# EAGLE schematic loa_v2 (EAGLE 5.12)

## Sheet 1 of 7
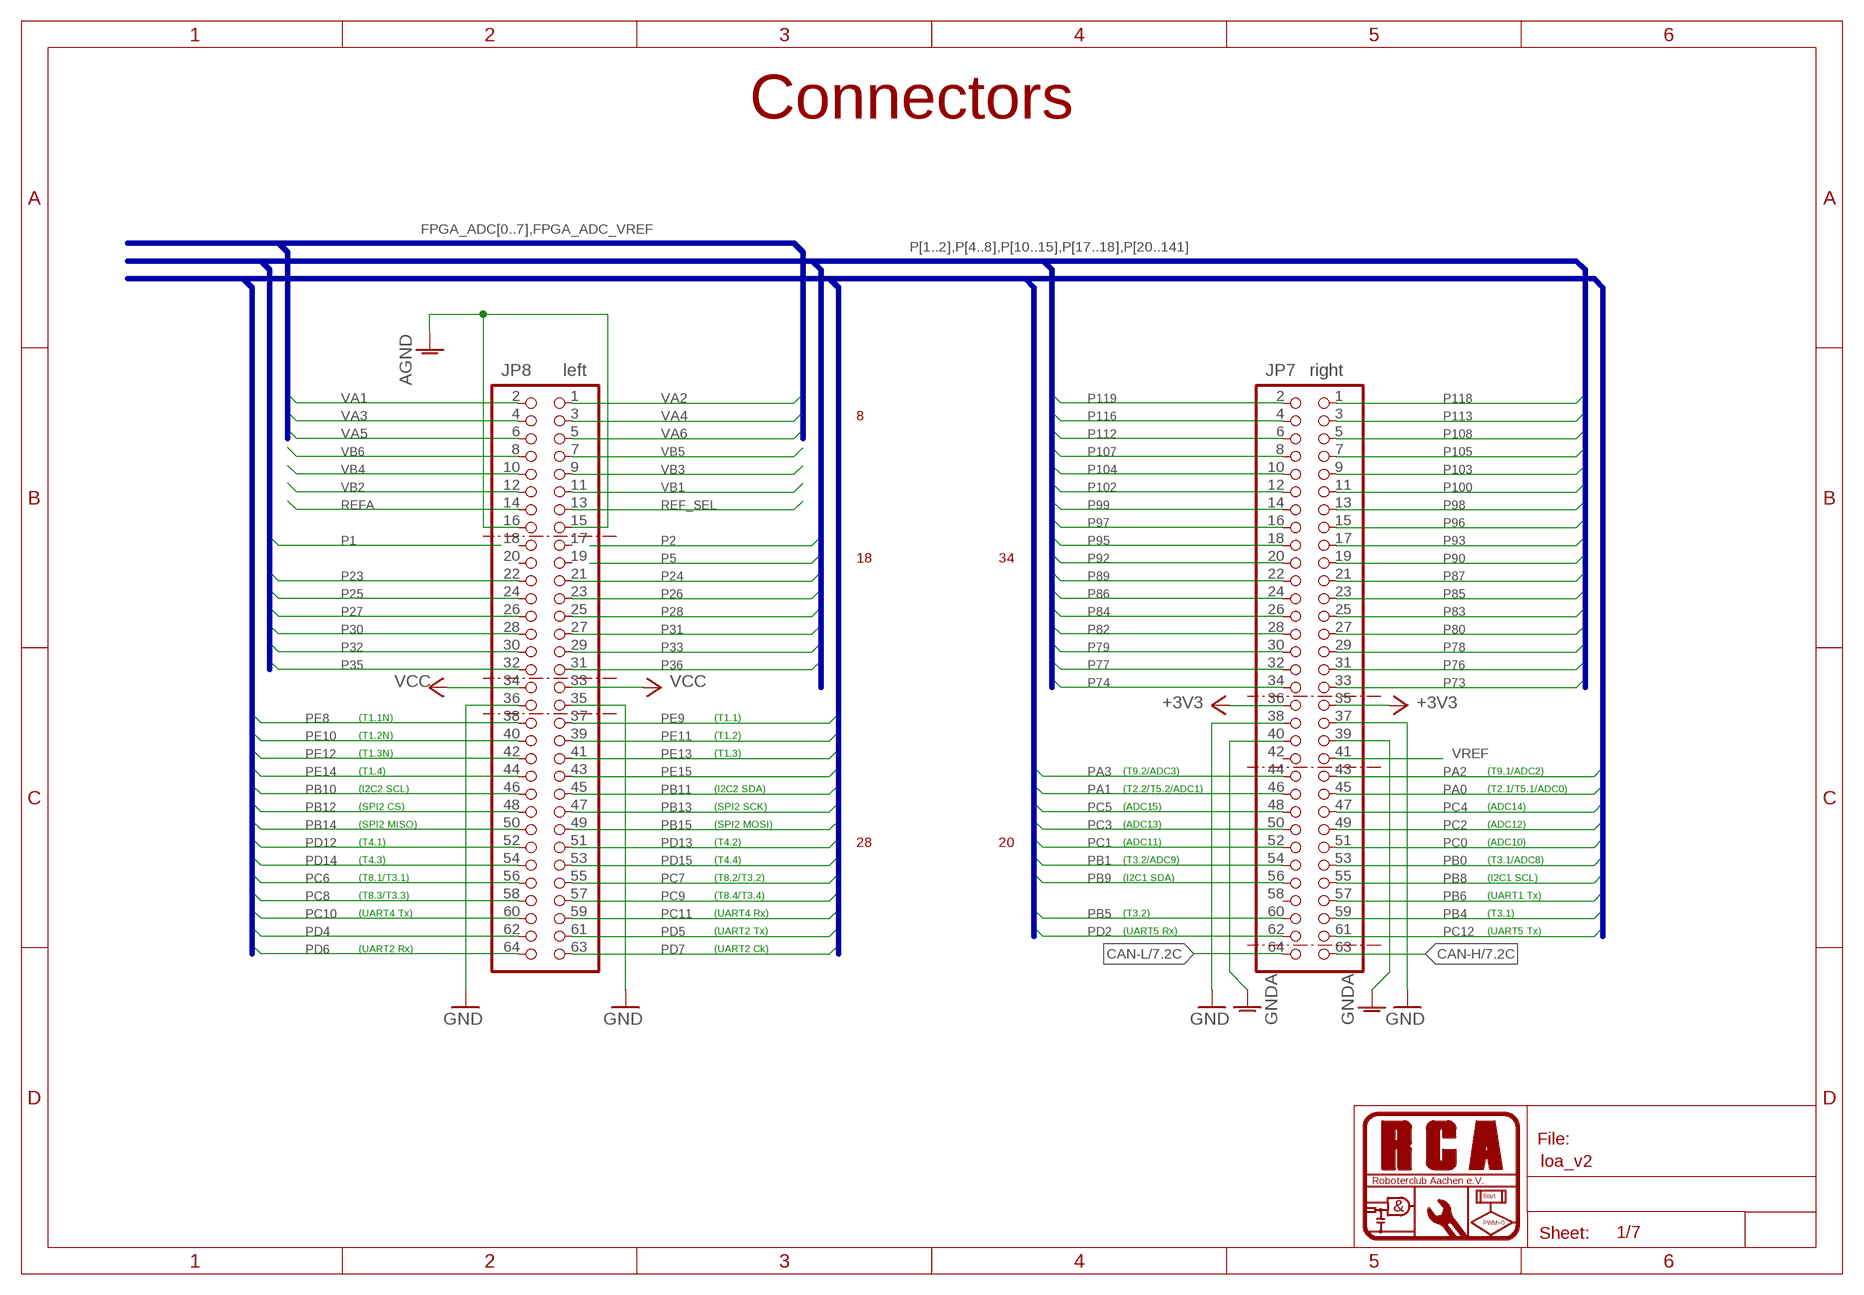
[diagram p0: schematic, sheet 1]

### Parts
JP7  right  PINHD-2X32_2.00-SMD  [2X32M_SMD]
JP8  left  PINHD-2X32_2.00-SMD  [2X32M_SMD]

### Nets
+3V3: JP7.35 JP7.36 ; also sheet 2,3,4,5,6,7
AGND: JP8.15 JP8.16 ; also sheet 3
CAN-H: JP7.63 ; also sheet 7
CAN-L: JP7.64 ; also sheet 7
GND: JP7.37 JP7.38 JP8.35 JP8.36 ; also sheet 2,3,4,5,6,7
GNDA: JP7.39 JP7.40 ; also sheet 6
P23: JP8.22 ; also sheet 2
P24: JP8.21 ; also sheet 2
P25: JP8.24 ; also sheet 2
P26: JP8.23 ; also sheet 2
P27: JP8.26 ; also sheet 2
P28: JP8.25 ; also sheet 2
P30: JP8.28 ; also sheet 2
P31: JP8.27 ; also sheet 2
P32: JP8.30 ; also sheet 2
P33: JP8.29 ; also sheet 2
P35: JP8.32 ; also sheet 2
P36: JP8.31 ; also sheet 2
P73: JP7.33 ; also sheet 2
P74: JP7.34 ; also sheet 2
P76: JP7.31 ; also sheet 2
P77: JP7.32 ; also sheet 2
P78: JP7.29 ; also sheet 2
P79: JP7.30 ; also sheet 2
P80: JP7.27 ; also sheet 2
P82: JP7.28 ; also sheet 2
P83: JP7.25 ; also sheet 2
P84: JP7.26 ; also sheet 2
P85: JP7.23 ; also sheet 2
P86: JP7.24 ; also sheet 2
P87: JP7.21 ; also sheet 2
P89: JP7.22 ; also sheet 2
P90: JP7.19 ; also sheet 2
P92: JP7.20 ; also sheet 2
P93: JP7.17 ; also sheet 2
P95: JP7.18 ; also sheet 2
P96: JP7.15 ; also sheet 2
P97: JP7.16 ; also sheet 2
P98: JP7.13 ; also sheet 2
P99: JP7.14 ; also sheet 2
P100: JP7.11 ; also sheet 2
P102: JP7.12 ; also sheet 2
P103: JP7.9 ; also sheet 2
P104: JP7.10 ; also sheet 2
P105: JP7.7 ; also sheet 2
P107: JP7.8 ; also sheet 2
P108: JP7.5 ; also sheet 2
P112: JP7.6 ; also sheet 2
P113: JP7.3 ; also sheet 2
P116: JP7.4 ; also sheet 2
P118: JP7.1 ; also sheet 2
P119: JP7.2 ; also sheet 2
PA0: JP7.45 ; also sheet 5
PA1: JP7.46 ; also sheet 5
PA2: JP7.43 ; also sheet 5
PA3: JP7.44 ; also sheet 5
PB0: JP7.53 ; also sheet 5
PB1: JP7.54 ; also sheet 5
PB4: JP7.59 ; also sheet 5
PB5: JP7.60 ; also sheet 5
PB6: JP7.57 ; also sheet 5
PB8: JP7.55 ; also sheet 5
PB9: JP7.56 ; also sheet 5
PB10: JP8.46 ; also sheet 5
PB11: JP8.45 ; also sheet 5
PB12: JP8.48 ; also sheet 5
PB13: JP8.47 ; also sheet 5
PB14: JP8.50 ; also sheet 5
PB15: JP8.49 ; also sheet 5
PC0: JP7.51 ; also sheet 5
PC1: JP7.52 ; also sheet 5
PC2: JP7.49 ; also sheet 5
PC3: JP7.50 ; also sheet 5
PC4: JP7.47 ; also sheet 5
PC5: JP7.48 ; also sheet 5
PC6: JP8.56 ; also sheet 5
PC7: JP8.55 ; also sheet 5
PC8: JP8.58 ; also sheet 5
PC9: JP8.57 ; also sheet 5
PC10: JP8.60 ; also sheet 5
PC11: JP8.59 ; also sheet 5
PC12: JP7.61 ; also sheet 5
PD2: JP7.62 ; also sheet 5
PD4: JP8.62
PD5: JP8.61
PD6: JP8.64
PD7: JP8.63
PD12: JP8.52
PD13: JP8.51
PD14: JP8.54
PD15: JP8.53
PE8: JP8.38
PE9: JP8.37
PE10: JP8.40
PE11: JP8.39
PE12: JP8.42
PE13: JP8.41
PE14: JP8.44
PE15: JP8.43
REF_SEL: JP8.13 ; also sheet 3
REFA: JP8.14 ; also sheet 3
VA1: JP8.2 ; also sheet 3
VA2: JP8.1 ; also sheet 3
VA3: JP8.4 ; also sheet 3
VA4: JP8.3 ; also sheet 3
VA5: JP8.6 ; also sheet 3
VA6: JP8.5 ; also sheet 3
VB1: JP8.11 ; also sheet 3
VB2: JP8.12 ; also sheet 3
VB3: JP8.9 ; also sheet 3
VB4: JP8.10 ; also sheet 3
VB5: JP8.7 ; also sheet 3
VB6: JP8.8 ; also sheet 3
VCC: JP8.33 JP8.34 ; also sheet 4,6
VREF: JP7.41 ; also sheet 6
Unconnected: JP7.42 JP7.58 JP8.17 JP8.18 JP8.19 JP8.20

### Buses
FPGA_ADC[0..7],FPGA_ADC_VREF
P[1..2],P[4..8],P[10..15],P[17..18],P[20..141]
PA[0..3],PA8,PB[0..2],PB[4..15],PC[0..12],PC14,FLASH_CS,PD2,SD_CS,PD[4..7],PD[12..15],PE[0..15]

### Notes on the sheet
- Connectors
- 8
- 18 | 34
- (T1.1N) | (T1.1)
- (T1.2N) | (T1.2)
- (T1.3N) | (T1.3)
- (T1.4) | (T9.2/ADC3) | (T9.1/ADC2)
- (I2C2 SCL) | (I2C2 SDA) | (T2.2/T5.2/ADC1) | (T2.1/T5.1/ADC0)
- (SPI2 CS) | (SPI2 SCK) | (ADC15) | (ADC14)
- (SPI2 MISO) | (SPI2 MOSI) | (ADC13) | (ADC12)
- (T4.1) | (T4.2) | 28 | 20 | (ADC11) | (ADC10)
- (T4.3) | (T4.4) | (T3.2/ADC9) | (T3.1/ADC8)
- (T8.1/T3.1) | (T8.2/T3.2) | (I2C1 SDA) | (I2C1 SCL)
- (T8.3/T3.3) | (T8.4/T3.4) | (UART1 Tx)
- (UART4 Tx) | (UART4 Rx) | (T3.2) | (T3.1)
- (UART2 Tx) | (UART5 Rx) | (UART5 Tx)
- (UART2 Rx) | (UART2 Ck)

## Sheet 2 of 7
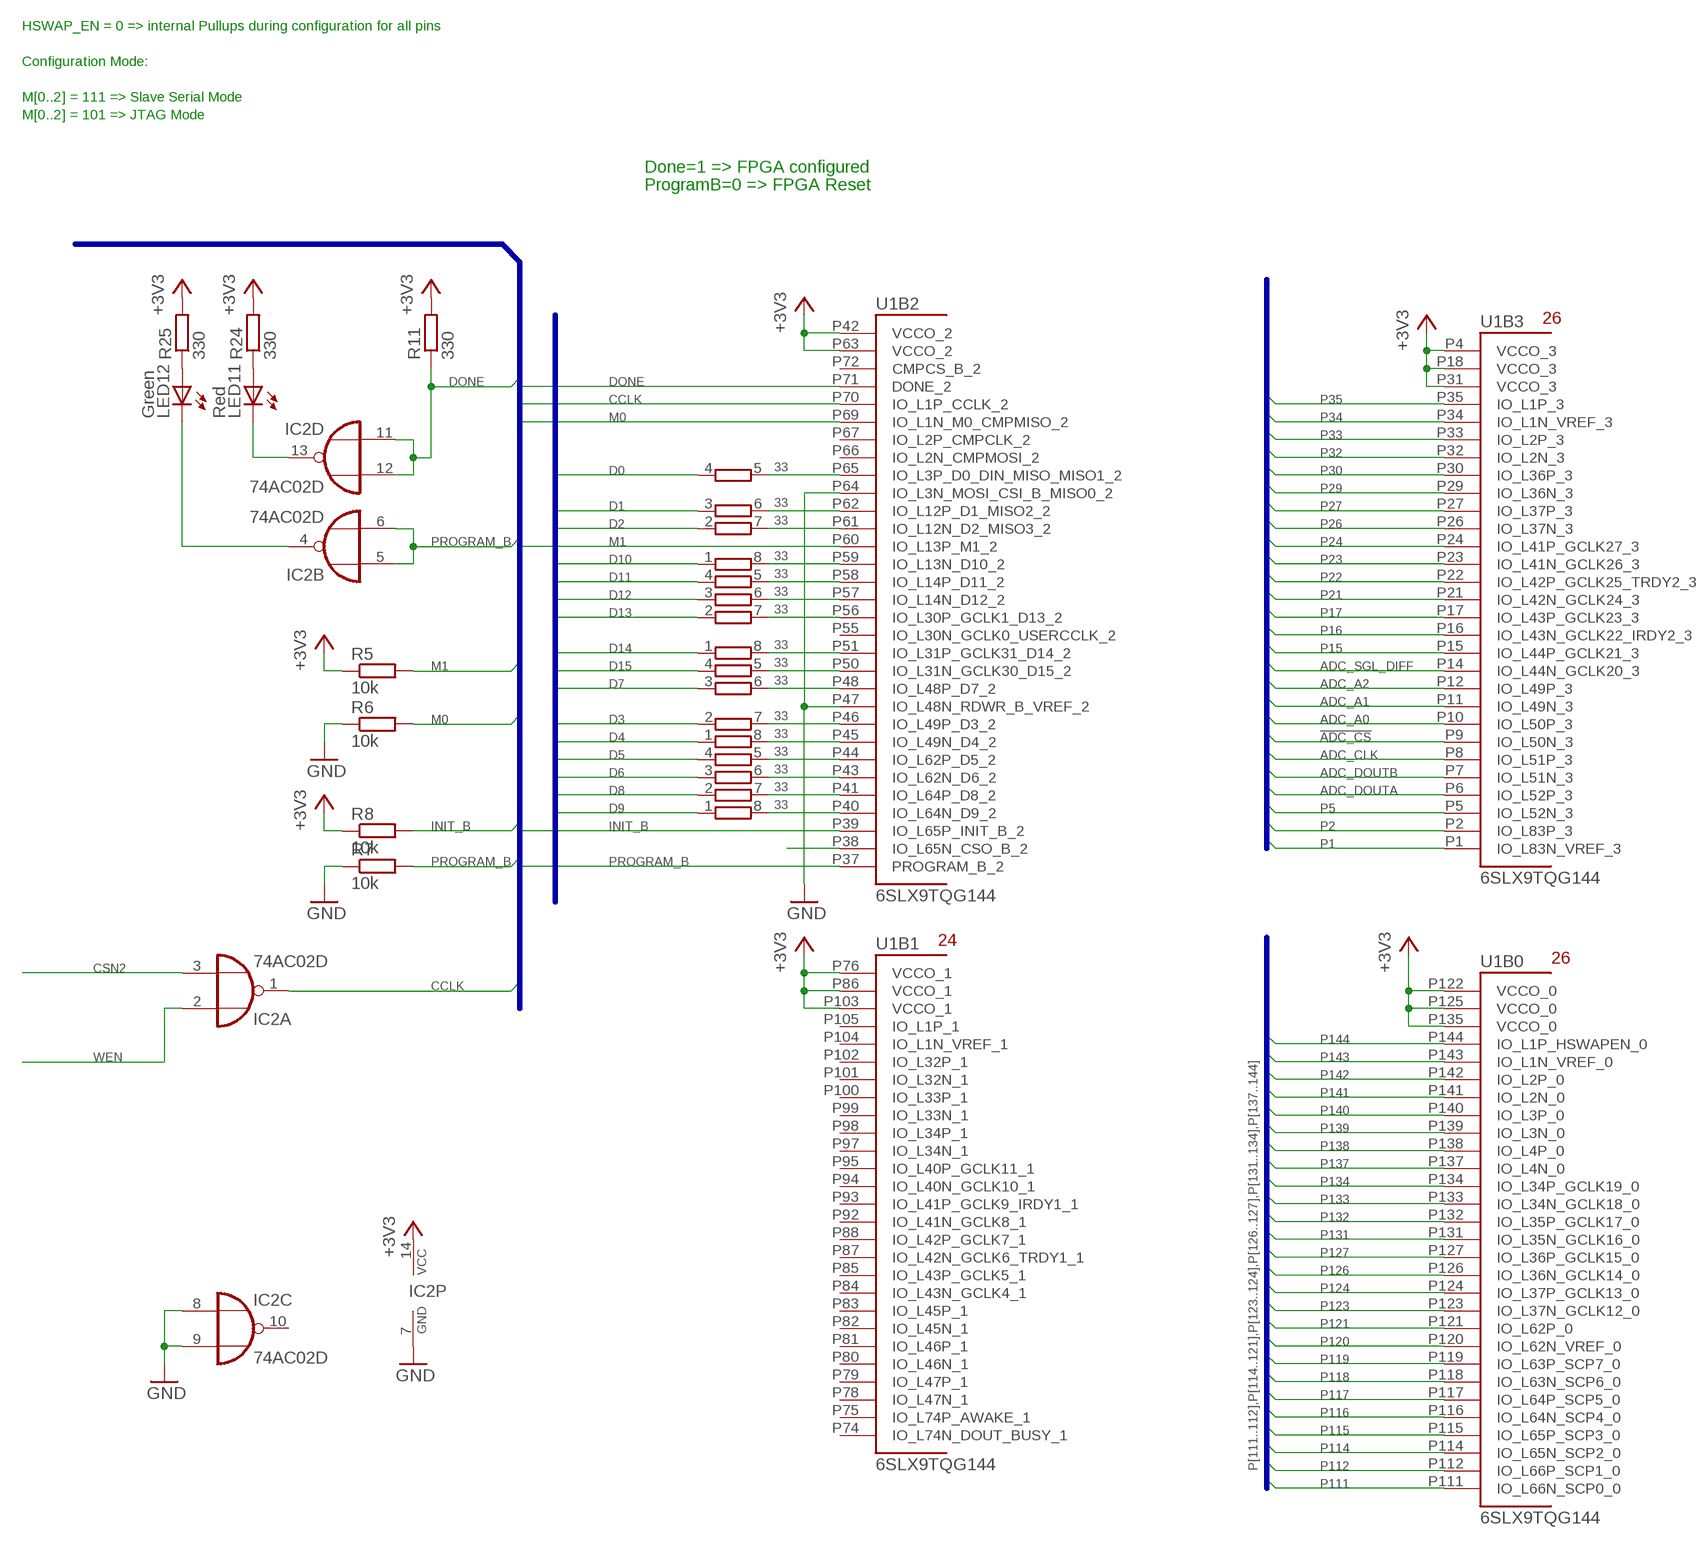
[diagram p1: schematic, sheet 2, part 1 of 3]
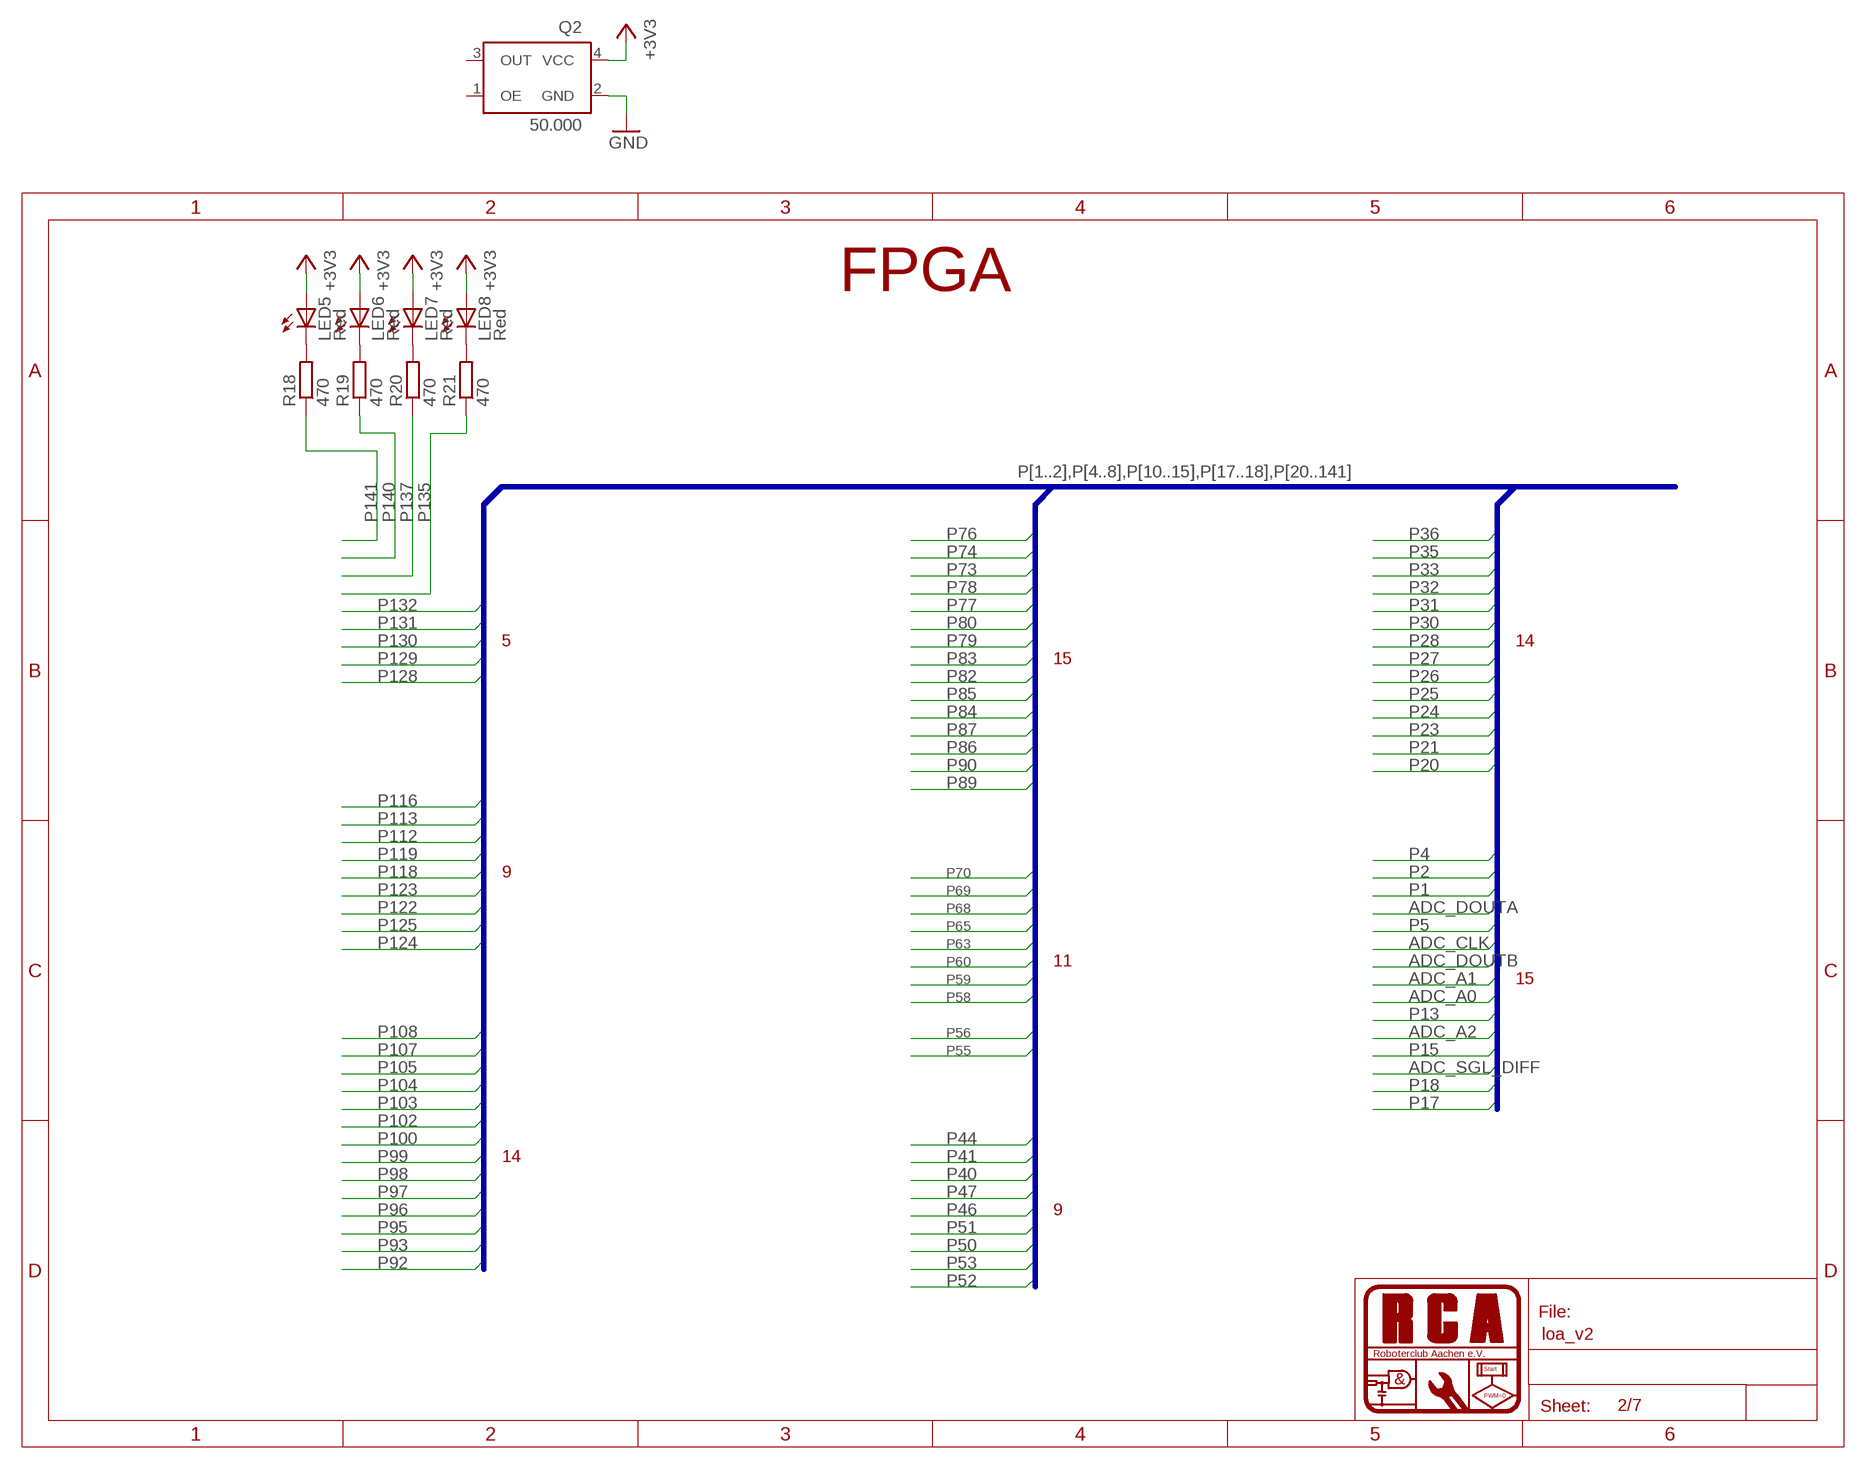
[diagram p2: schematic, sheet 2, part 2 of 3]
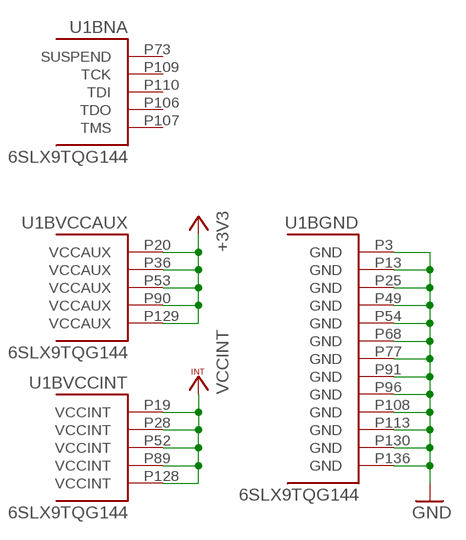
[diagram p3: schematic, sheet 2, part 3 of 3]

### Parts
IC2  74AC02D  [SO14]
LED5  Red  LEDCHIPLED_0805  [CHIPLED_0805]
LED6  Red  LEDCHIPLED_0805  [CHIPLED_0805]
LED7  Red  LEDCHIPLED_0805  [CHIPLED_0805]
LED8  Red  LEDCHIPLED_0805  [CHIPLED_0805]
LED11  Red  LEDCHIPLED_0805  [CHIPLED_0805]
LED12  Green  LEDCHIPLED_0805  [CHIPLED_0805]
Q2  50.000  XO53  [XO53]
R5  10k  R-EU_R0603  [R0603]
R6  10k  R-EU_R0603  [R0603]
R7  10k  R-EU_R0603  [R0603]
R8  10k  R-EU_R0603  [R0603]
R11  330  R-EU_R0603  [R0603]
R18  470  R-EU_R0805  [R0805]
R19  470  R-EU_R0805  [R0805]
R20  470  R-EU_R0805  [R0805]
R21  470  R-EU_R0805  [R0805]
R24  330  R-EU_R0603  [R0603]
R25  330  R-EU_R0603  [R0603]
RN3  33  4R-NEXB38V  [EXB38V]
RN4  33  4R-NEXB38V  [EXB38V]
RN6  33  4R-NEXB38V  [EXB38V]
RN7  33  4R-NEXB38V  [EXB38V]
U1  6SLX9TQG144  [TQ144]

### Nets
!ADC_CS: U1.P9(B3:IO_L50N_3) ; also sheet 3
+3V3: IC2.14(P:VCC) LED5.A LED6.A LED7.A LED8.A Q2.4(VCC) R5.1 R8.1 R11.2 R24.2 R25.2 U1.P4(B3:VCCO_3) U1.P18(B3:VCCO_3) U1.P20(BVCCAUX:VCCAUX) U1.P31(B3:VCCO_3) U1.P36(BVCCAUX:VCCAUX) U1.P42(B2:VCCO_2) U1.P53(BVCCAUX:VCCAUX) U1.P63(B2:VCCO_2) U1.P76(B1:VCCO_1) U1.P86(B1:VCCO_1) U1.P90(BVCCAUX:VCCAUX) U1.P103(B1:VCCO_1) U1.P122(B0:VCCO_0) U1.P125(B0:VCCO_0) U1.P129(BVCCAUX:VCCAUX) U1.P135(B0:VCCO_0) ; also sheet 1,3,4,5,6,7
ADC_A0: U1.P10(B3:IO_L50P_3) ; also sheet 3
ADC_A1: U1.P11(B3:IO_L49N_3) ; also sheet 3
ADC_A2: U1.P12(B3:IO_L49P_3) ; also sheet 3
ADC_CLK: U1.P8(B3:IO_L51P_3) ; also sheet 3
ADC_DOUTA: U1.P6(B3:IO_L52P_3) ; also sheet 3
ADC_DOUTB: U1.P7(B3:IO_L51N_3) ; also sheet 3
ADC_SGL_DIFF: U1.P14(B3:IO_L44N_GCLK20_3) ; also sheet 3
CCLK: IC2.1(A:O) U1.P70(B2:IO_L1P_CCLK_2)
CSN2: IC2.3(A:I1)
D0: RN3.4 ; also sheet 5
D1: RN3.3 ; also sheet 5
D2: RN3.2 ; also sheet 5
D3: RN7.2 ; also sheet 5
D4: RN7.1 ; also sheet 5
D5: RN4.4 ; also sheet 5
D6: RN4.3 ; also sheet 5
D7: RN7.3 ; also sheet 5
D8: RN4.2 ; also sheet 5
D9: RN4.1 ; also sheet 5
D10: RN3.1 ; also sheet 5
D11: RN6.4 ; also sheet 5
D12: RN6.3 ; also sheet 5
D13: RN6.2 ; also sheet 5
D14: RN6.1 ; also sheet 5
D15: RN7.4 ; also sheet 5
DONE: IC2.11(D:I0) IC2.12(D:I1) R11.1 U1.P71(B2:DONE_2)
GND: IC2.7(P:GND) IC2.8(C:I0) IC2.9(C:I1) Q2.2(GND) R6.1 R7.1 U1.P3(BGND:GND) U1.P13(BGND:GND) U1.P25(BGND:GND) U1.P47(B2:IO_L48N_RDWR_B_VREF_2) U1.P49(BGND:GND) U1.P54(BGND:GND) U1.P64(B2:IO_L3N_MOSI_CSI_B_MISO0_2) U1.P68(BGND:GND) U1.P77(BGND:GND) U1.P91(BGND:GND) U1.P96(BGND:GND) U1.P108(BGND:GND) U1.P113(BGND:GND) U1.P130(BGND:GND) U1.P136(BGND:GND) ; also sheet 1,3,4,5,6,7
INIT_B: R8.2 U1.P39(B2:IO_L65P_INIT_B_2)
M0: R6.2 U1.P69(B2:IO_L1N_M0_CMPMISO_2)
M1: R5.2 U1.P60(B2:IO_L13P_M1_2)
N$2: RN3.5 U1.P65(B2:IO_L3P_D0_DIN_MISO_MISO1_2)
N$3: RN3.6 U1.P62(B2:IO_L12P_D1_MISO2_2)
N$5: RN3.7 U1.P61(B2:IO_L12N_D2_MISO3_2)
N$6: RN3.8 U1.P59(B2:IO_L13N_D10_2)
N$7: RN6.5 U1.P58(B2:IO_L14P_D11_2)
N$8: RN6.6 U1.P57(B2:IO_L14N_D12_2)
N$9: RN6.7 U1.P56(B2:IO_L30P_GCLK1_D13_2)
N$10: RN6.8 U1.P51(B2:IO_L31P_GCLK31_D14_2)
N$11: RN7.5 U1.P50(B2:IO_L31N_GCLK30_D15_2)
N$12: RN7.6 U1.P48(B2:IO_L48P_D7_2)
N$13: RN7.7 U1.P46(B2:IO_L49P_D3_2)
N$14: RN7.8 U1.P45(B2:IO_L49N_D4_2)
N$15: RN4.5 U1.P44(B2:IO_L62P_D5_2)
N$22: LED8.C R21.2
N$23: LED7.C R20.2
N$24: LED6.C R19.2
N$25: LED5.C R18.2
N$35: RN4.7 U1.P41(B2:IO_L64P_D8_2)
N$44: RN4.6 U1.P43(B2:IO_L62N_D6_2)
N$45: RN4.8 U1.P40(B2:IO_L64N_D9_2)
N$46: U1.P38(B2:IO_L65N_CSO_B_2)
N$47: LED11.A R24.1
N$48: IC2.13(D:O) LED11.C
N$49: LED12.A R25.1
N$50: IC2.4(B:O) LED12.C
P1: U1.P1(B3:IO_L83N_VREF_3) ; also sheet 1
P2: U1.P2(B3:IO_L83P_3) ; also sheet 1
P5: U1.P5(B3:IO_L52N_3) ; also sheet 1
P15: U1.P15(B3:IO_L44P_GCLK21_3)
P16: U1.P16(B3:IO_L43N_GCLK22_IRDY2_3)
P17: U1.P17(B3:IO_L43P_GCLK23_3)
P21: U1.P21(B3:IO_L42N_GCLK24_3)
P22: U1.P22(B3:IO_L42P_GCLK25_TRDY2_3)
P23: U1.P23(B3:IO_L41N_GCLK26_3) ; also sheet 1
P24: U1.P24(B3:IO_L41P_GCLK27_3) ; also sheet 1
P26: U1.P26(B3:IO_L37N_3) ; also sheet 1
P27: U1.P27(B3:IO_L37P_3) ; also sheet 1
P29: U1.P29(B3:IO_L36N_3)
P30: U1.P30(B3:IO_L36P_3) ; also sheet 1
P32: U1.P32(B3:IO_L2N_3) ; also sheet 1
P33: U1.P33(B3:IO_L2P_3) ; also sheet 1
P34: U1.P34(B3:IO_L1N_VREF_3)
P35: U1.P35(B3:IO_L1P_3) ; also sheet 1
P111: U1.P111(B0:IO_L66N_SCP0_0)
P112: U1.P112(B0:IO_L66P_SCP1_0) ; also sheet 1
P114: U1.P114(B0:IO_L65N_SCP2_0)
P115: U1.P115(B0:IO_L65P_SCP3_0)
P116: U1.P116(B0:IO_L64N_SCP4_0) ; also sheet 1
P117: U1.P117(B0:IO_L64P_SCP5_0)
P118: U1.P118(B0:IO_L63N_SCP6_0) ; also sheet 1
P119: U1.P119(B0:IO_L63P_SCP7_0) ; also sheet 1
P120: U1.P120(B0:IO_L62N_VREF_0)
P121: U1.P121(B0:IO_L62P_0)
P123: U1.P123(B0:IO_L37N_GCLK12_0)
P124: U1.P124(B0:IO_L37P_GCLK13_0)
P126: U1.P126(B0:IO_L36N_GCLK14_0)
P127: U1.P127(B0:IO_L36P_GCLK15_0)
P131: U1.P131(B0:IO_L35N_GCLK16_0)
P132: U1.P132(B0:IO_L35P_GCLK17_0)
P133: U1.P133(B0:IO_L34N_GCLK18_0)
P134: U1.P134(B0:IO_L34P_GCLK19_0)
P135: R21.1
P137: R20.1 U1.P137(B0:IO_L4N_0)
P138: U1.P138(B0:IO_L4P_0)
P139: U1.P139(B0:IO_L3N_0)
P140: R19.1 U1.P140(B0:IO_L3P_0)
P141: R18.1 U1.P141(B0:IO_L2N_0)
P142: U1.P142(B0:IO_L2P_0)
P143: U1.P143(B0:IO_L1N_VREF_0)
P144: U1.P144(B0:IO_L1P_HSWAPEN_0)
PROGRAM_B: IC2.5(B:I0) IC2.6(B:I1) R7.2 U1.P37(B2:PROGRAM_B_2)
VCCINT: U1.P19(BVCCINT:VCCINT) U1.P28(BVCCINT:VCCINT) U1.P52(BVCCINT:VCCINT) U1.P89(BVCCINT:VCCINT) U1.P128(BVCCINT:VCCINT) ; also sheet 4
WEN: IC2.2(A:I0)
Unconnected: IC2.10(C:O) Q2.1(OE) Q2.3(OUT) U1.P55(B2:IO_L30N_GCLK0_USERCCLK_2) U1.P66(B2:IO_L2N_CMPMOSI_2) U1.P67(B2:IO_L2P_CMPCLK_2) U1.P72(B2:CMPCS_B_2) U1.P73(BNA:SUSPEND) U1.P74(B1:IO_L74N_DOUT_BUSY_1) U1.P75(B1:IO_L74P_AWAKE_1) U1.P78(B1:IO_L47N_1) U1.P79(B1:IO_L47P_1) U1.P80(B1:IO_L46N_1) U1.P81(B1:IO_L46P_1) U1.P82(B1:IO_L45N_1) U1.P83(B1:IO_L45P_1) U1.P84(B1:IO_L43N_GCLK4_1) U1.P85(B1:IO_L43P_GCLK5_1) U1.P87(B1:IO_L42N_GCLK6_TRDY1_1) U1.P88(B1:IO_L42P_GCLK7_1) U1.P92(B1:IO_L41N_GCLK8_1) U1.P93(B1:IO_L41P_GCLK9_IRDY1_1) U1.P94(B1:IO_L40N_GCLK10_1) U1.P95(B1:IO_L40P_GCLK11_1) U1.P97(B1:IO_L34N_1) U1.P98(B1:IO_L34P_1) U1.P99(B1:IO_L33N_1) U1.P100(B1:IO_L33P_1) U1.P101(B1:IO_L32N_1) U1.P102(B1:IO_L32P_1) U1.P104(B1:IO_L1N_VREF_1) U1.P105(B1:IO_L1P_1) U1.P106(BNA:TDO) U1.P107(BNA:TMS) U1.P109(BNA:TCK) U1.P110(BNA:TDI)

### Buses
P[1..2],P[4..8],P[10..15],P[17..18],P[20..141]
M[0..1],CCLK,DONE,INIT_B,PROGAM_B
P[1..2],P[5..12],P[14..17],P[21..24],P[26..27],P[29..30],P[32..35]
P[111..112],P[114..121],P[123..124],P[126..127],P[131..134],P[137..144]
B$1

### Notes on the sheet
- HSWAP_EN = 0 => internal Pullups during configuration for all pins
- Configuration Mode:
- M[0..2] = 111 => Slave Serial Mode
- M[0..2] = 101 => JTAG Mode
- Done=1 => FPGA configured
- ProgramB=0 => FPGA Reset
- 26
- 24
- 26
- FPGA
- 5 | 14
- 15
- 9
- 11
- 15
- 14
- 9

## Sheet 3 of 7
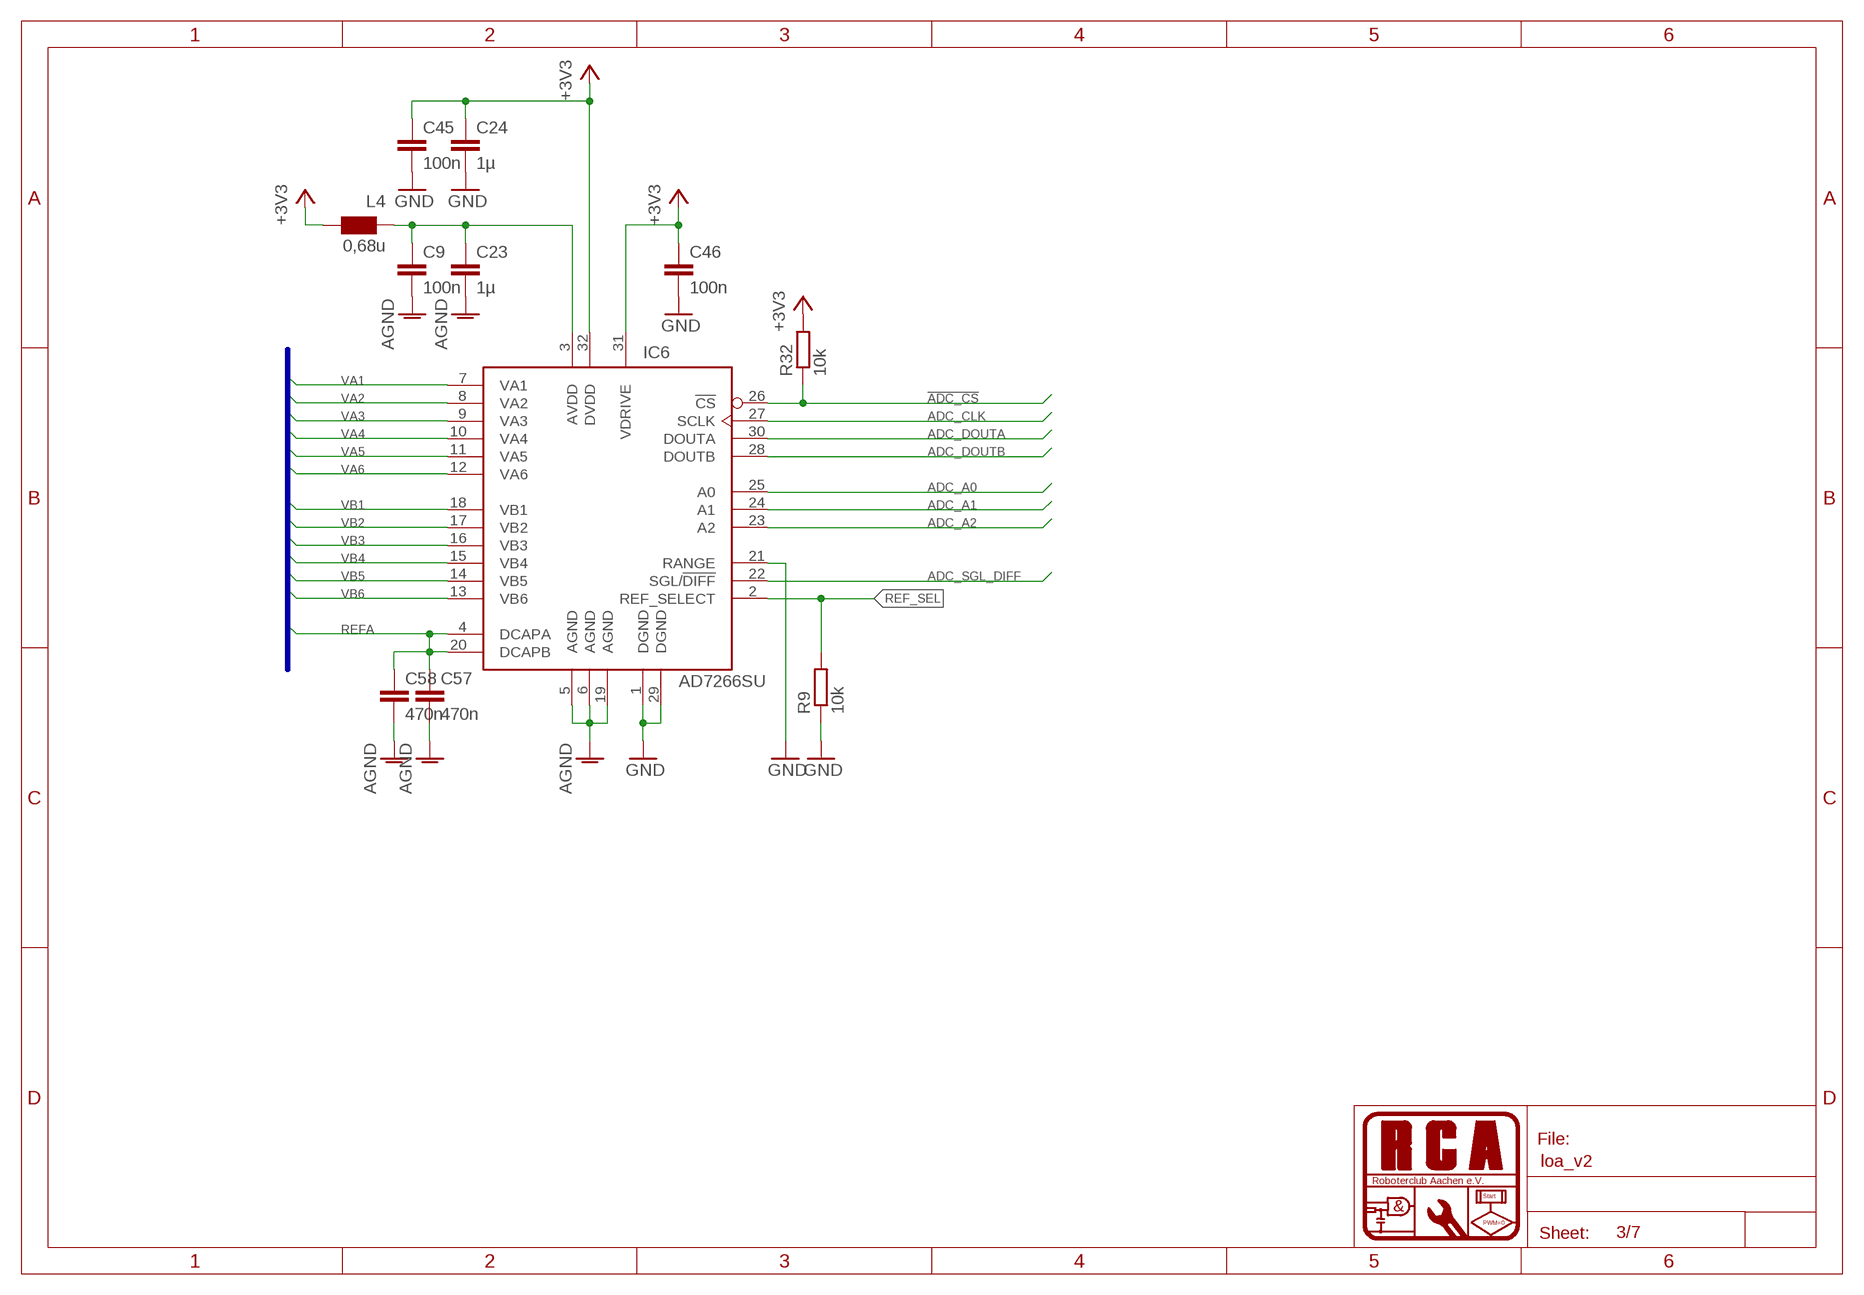
[diagram p4: schematic, sheet 3]

### Parts
C9  100n  C-EUC0603  [C0603]
C23  1µ  C-EUC0805  [C0805]
C24  1µ  C-EUC0805  [C0805]
C45  100n  C-EUC0603  [C0603]
C46  100n  C-EUC0603  [C0603]
C57  470n  C-EUC0805  [C0805]
C58  470n  C-EUC0805  [C0805]
IC6  AD7266SU  [TQFP32-08]
L4  0,68u  WE-KIHQ_0805  [WE-KI_0805_B]
R9  10k  R-EU_R0603  [R0603]
R32  10k  R-EU_R0603  [R0603]

### Nets
!ADC_CS: IC6.26(!CS) R32.1 ; also sheet 2
+3V3: C24.1 C45.1 C46.1 IC6.31(VDRIVE) IC6.32(DVDD) L4.1 R32.2 ; also sheet 1,2,4,5,6,7
ADC_A0: IC6.25(A0) ; also sheet 2
ADC_A1: IC6.24(A1) ; also sheet 2
ADC_A2: IC6.23(A2) ; also sheet 2
ADC_CLK: IC6.27(SCLK) ; also sheet 2
ADC_DOUTA: IC6.30(DOUTA) ; also sheet 2
ADC_DOUTB: IC6.28(DOUTB) ; also sheet 2
ADC_SGL_DIFF: IC6.22(SGL/!DIFF) ; also sheet 2
AGND: C9.2 C23.2 C57.2 C58.2 IC6.5(AGND) IC6.6(AGND) IC6.19(AGND) ; also sheet 1
GND: C24.2 C45.2 C46.2 IC6.1(DGND) IC6.21(RANGE) IC6.29(DGND) R9.1 ; also sheet 1,2,4,5,6,7
N$55: C9.1 C23.1 IC6.3(AVDD) L4.2
REF_SEL: IC6.2(REF_SELECT) R9.2 ; also sheet 1
REFA: C57.1 C58.1 IC6.4(DCAPA) IC6.20(DCAPB) ; also sheet 1
VA1: IC6.7(VA1) ; also sheet 1
VA2: IC6.8(VA2) ; also sheet 1
VA3: IC6.9(VA3) ; also sheet 1
VA4: IC6.10(VA4) ; also sheet 1
VA5: IC6.11(VA5) ; also sheet 1
VA6: IC6.12(VA6) ; also sheet 1
VB1: IC6.18(VB1) ; also sheet 1
VB2: IC6.17(VB2) ; also sheet 1
VB3: IC6.16(VB3) ; also sheet 1
VB4: IC6.15(VB4) ; also sheet 1
VB5: IC6.14(VB5) ; also sheet 1
VB6: IC6.13(VB6) ; also sheet 1

### Buses
VA[1..6],VB[1..6],REFA

## Sheet 4 of 7
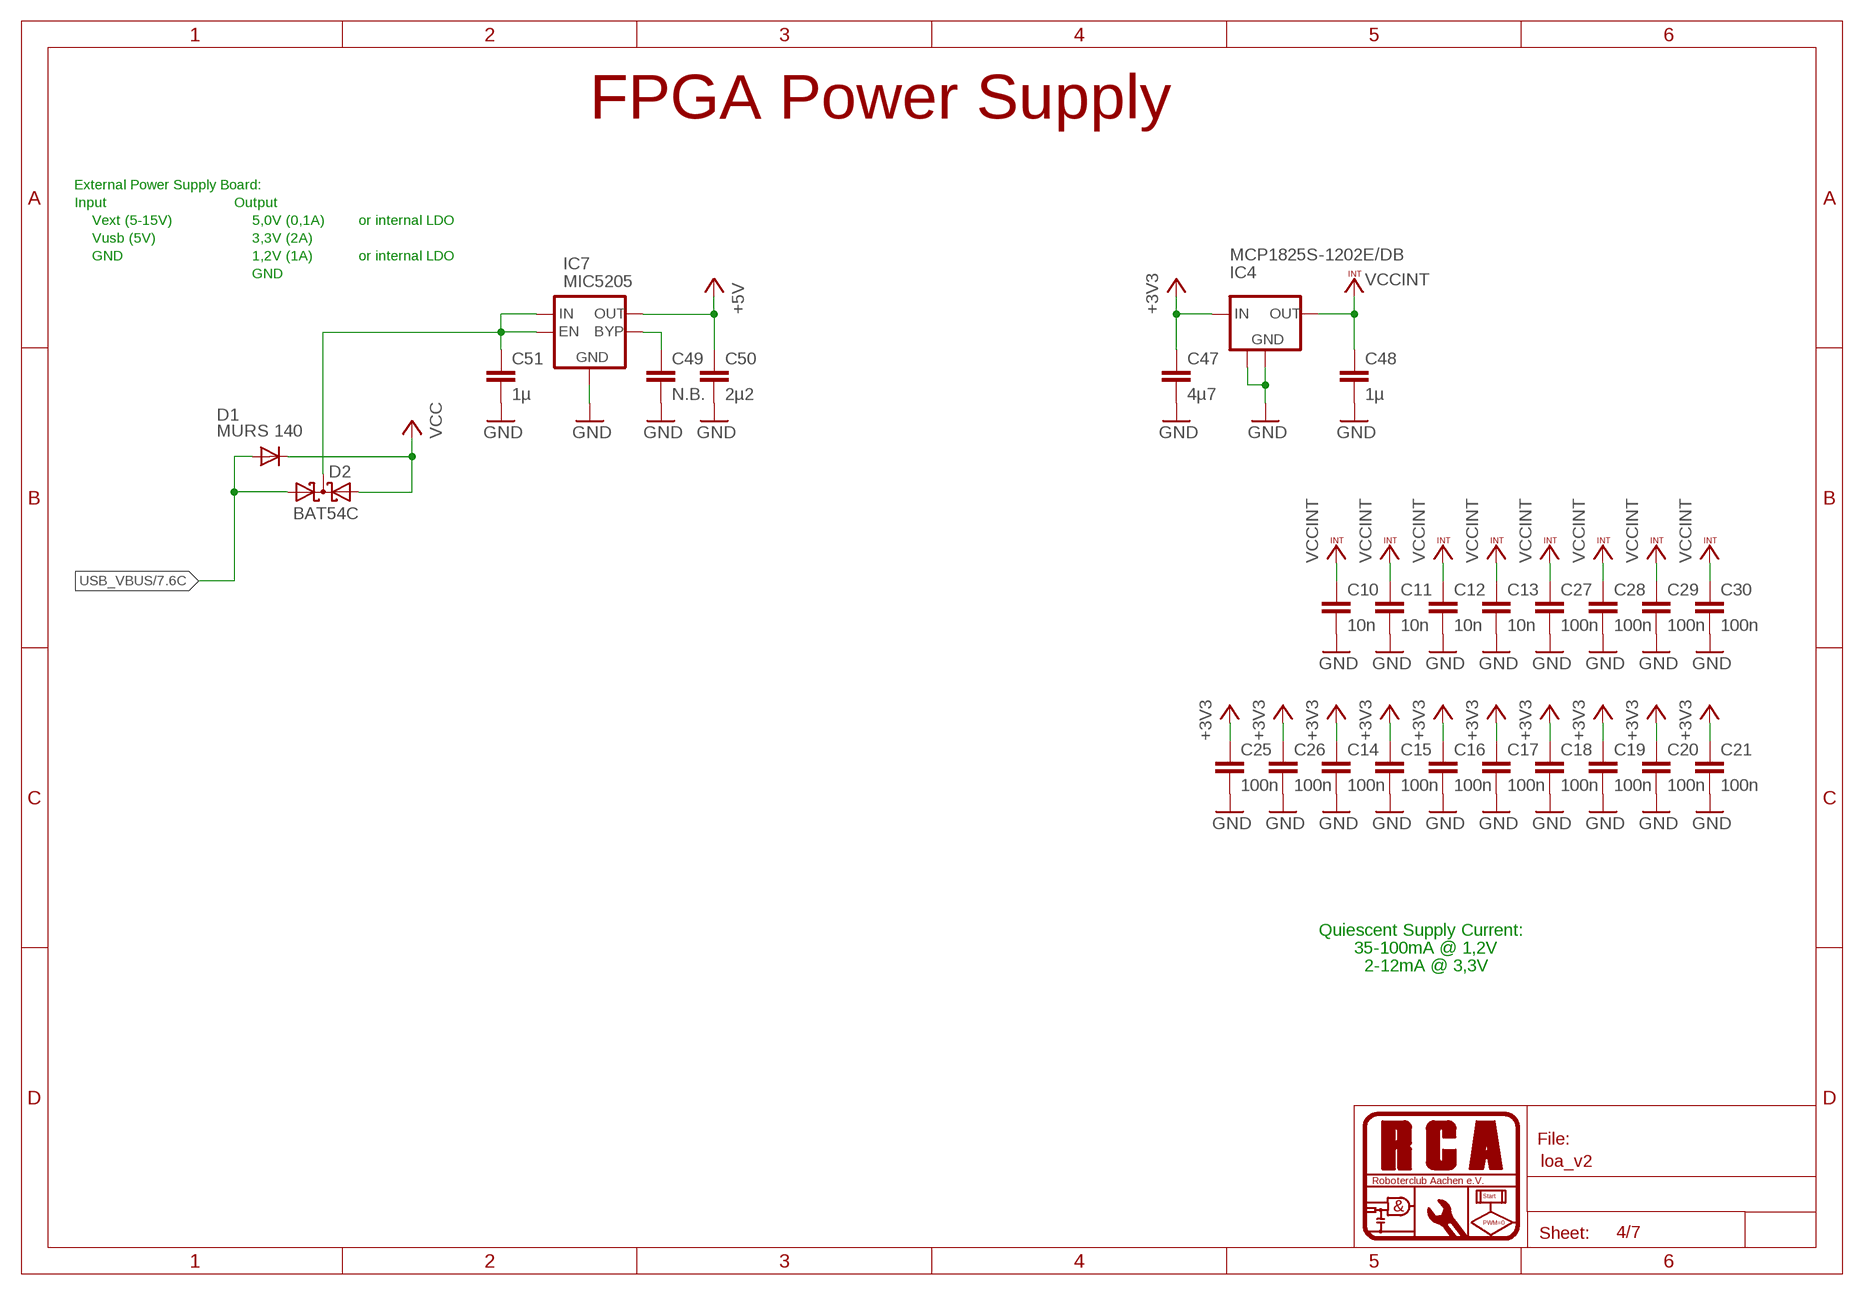
[diagram p5: schematic, sheet 4]

### Parts
C10  10n  C-EUC0603  [C0603]
C11  10n  C-EUC0603  [C0603]
C12  10n  C-EUC0603  [C0603]
C13  10n  C-EUC0603  [C0603]
C14  100n  C-EUC0603  [C0603]
C15  100n  C-EUC0603  [C0603]
C16  100n  C-EUC0603  [C0603]
C17  100n  C-EUC0603  [C0603]
C18  100n  C-EUC0603  [C0603]
C19  100n  C-EUC0603  [C0603]
C20  100n  C-EUC0603  [C0603]
C21  100n  C-EUC0603  [C0603]
C25  100n  C-EUC0603  [C0603]
C26  100n  C-EUC0603  [C0603]
C27  100n  C-EUC0603  [C0603]
C28  100n  C-EUC0603  [C0603]
C29  100n  C-EUC0603  [C0603]
C30  100n  C-EUC0603  [C0603]
C47  4µ7  C-EUC0805  [C0805]
C48  1µ  C-EUC0805  [C0805]
C49  N.B.  C-EUC0805  [C0805]
C50  2µ2  C-EUC0805  [C0805]
C51  1µ  C-EUC0805  [C0805]
D1  MURS 140  DIODE-SMB  [SMB]
D2  BAT54C  [SOT23]
IC4  MCP1825S-1202E/DB  MCP1825DB  [SOT223]
IC7  MIC5205  [SOT23-5L]

### Nets
+3V3: C14.1 C15.1 C16.1 C17.1 C18.1 C19.1 C20.1 C21.1 C25.1 C26.1 C47.1 IC4.1(IN) ; also sheet 1,2,3,5,6,7
+5V: C50.1 IC7.5(OUT) ; also sheet 7
GND: C10.2 C11.2 C12.2 C13.2 C14.2 C15.2 C16.2 C17.2 C18.2 C19.2 C20.2 C21.2 C25.2 C26.2 C27.2 C28.2 C29.2 C30.2 C47.2 C48.2 C49.2 C50.2 C51.2 IC4.2(GND) IC4.4(GND) IC7.2(GND) ; also sheet 1,2,3,5,6,7
N$40: C49.1 IC7.4(BYP)
N$43: C51.1 D2.3(CC) IC7.1(IN) IC7.3(EN)
USB_VBUS: D1.A D2.1(A1) ; also sheet 5,7
VCC: D1.C D2.2(A2) ; also sheet 1,6
VCCINT: C10.1 C11.1 C12.1 C13.1 C27.1 C28.1 C29.1 C30.1 C48.1 IC4.3(OUT) ; also sheet 2

### Notes on the sheet
- FPGA Power Supply
- External Power Supply Board:
- Input | Output
- Vext (5-15V) | 5,0V (0,1A) | or internal LDO
- Vusb (5V) | 3,3V (2A)
- GND | 1,2V (1A) | or internal LDO
- GND
- Quiescent Supply Current:
- 35-100mA @ 1,2V
- 2-12mA @ 3,3V

## Sheet 5 of 7
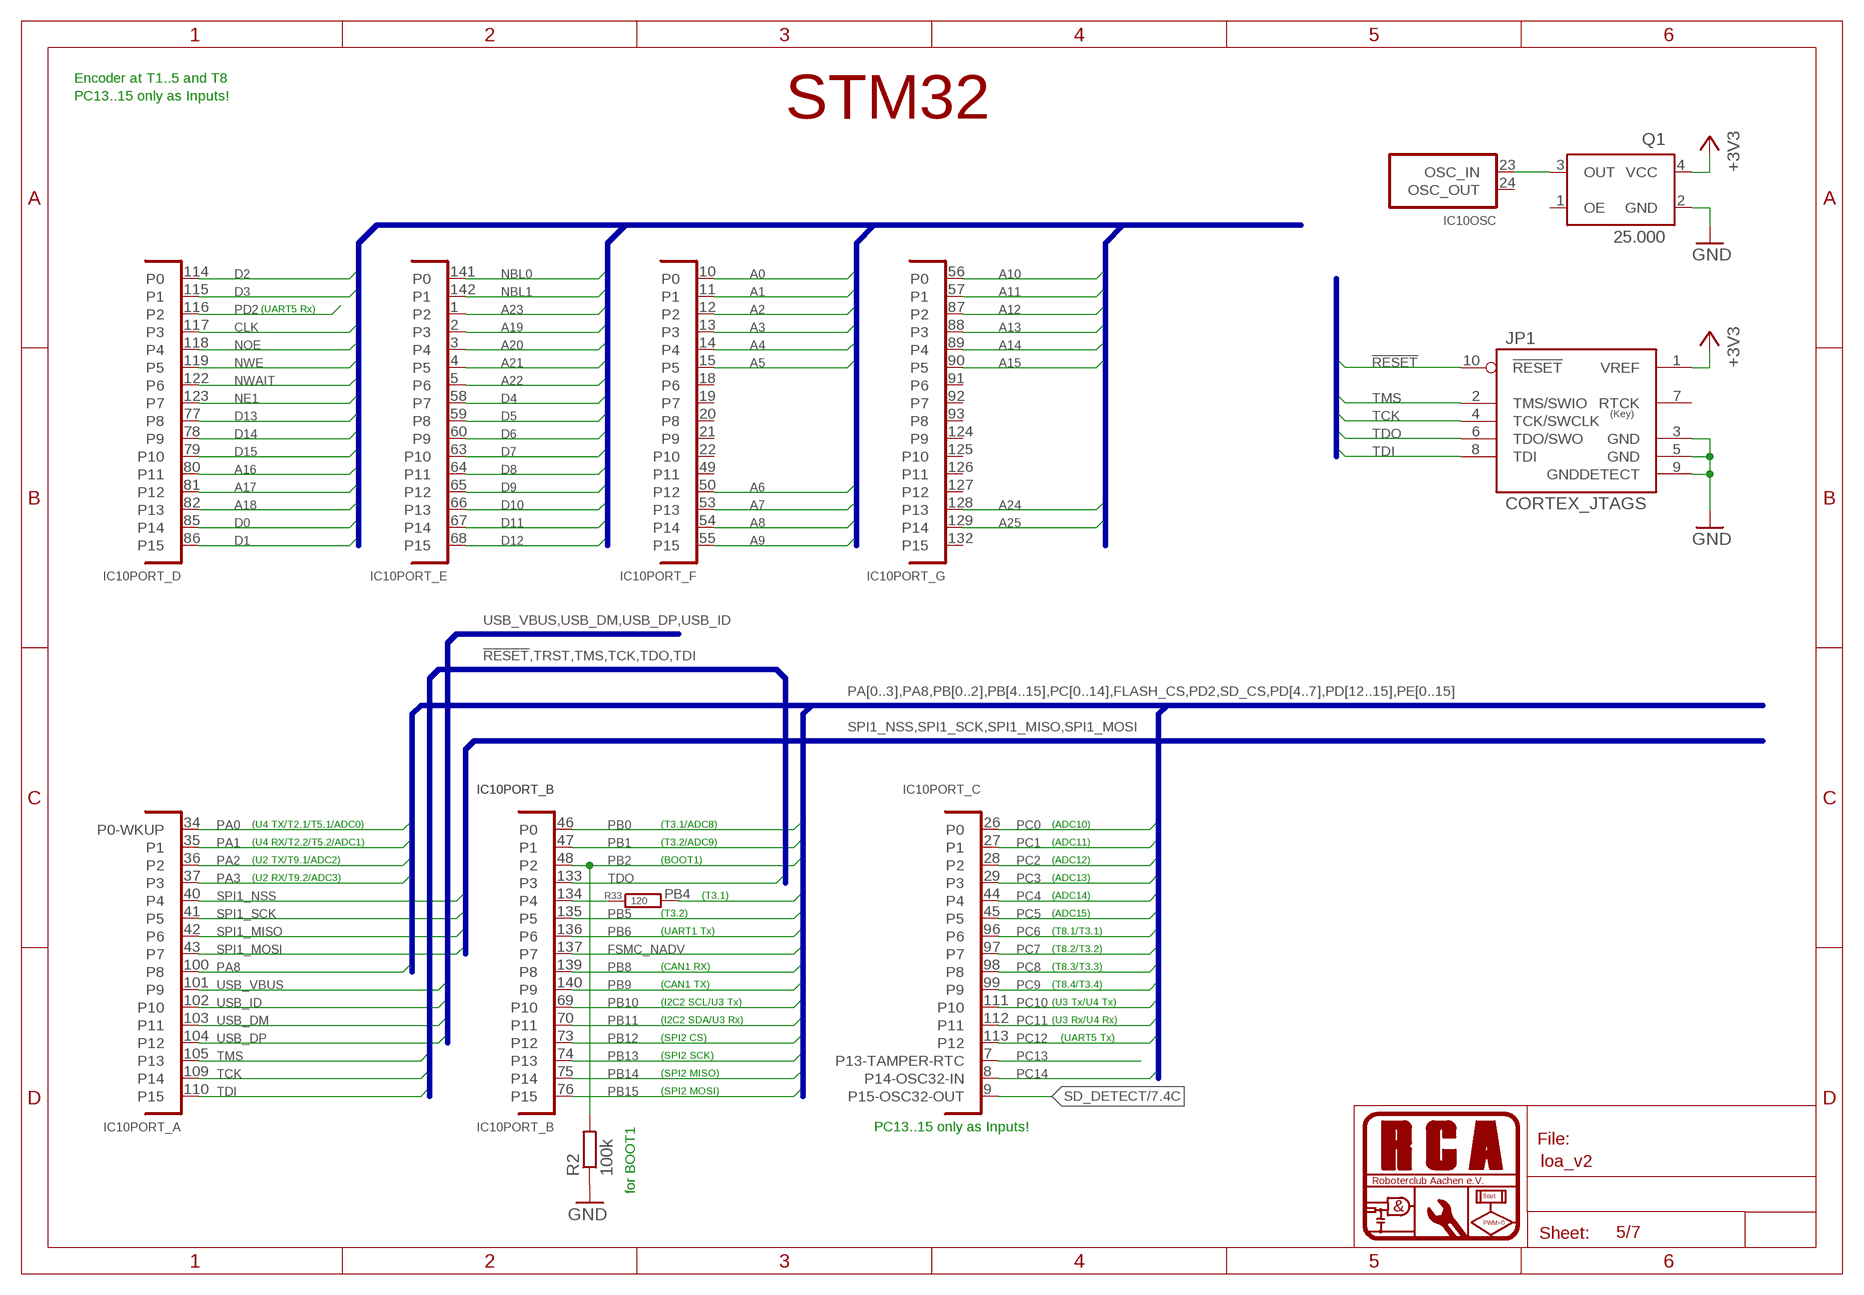
[diagram p6: schematic, sheet 5]

### Parts
IC10  STM32F10XZX  [TQFP144]
JP1  CORTEX_JTAGS  [2X05SMD]
Q1  25.000  XO53  [XO53]
R2  100k  R-EU_R0805  [R0805]
R33  120  R-EU_R0805  [R0805]

### Nets
!RESET: JP1.10(!RESET) ; also sheet 6
+3V3: JP1.1(VREF) Q1.4(VCC) ; also sheet 1,2,3,4,6,7
A0: IC10.10(PORT_F:P0)
A1: IC10.11(PORT_F:P1)
A2: IC10.12(PORT_F:P2)
A3: IC10.13(PORT_F:P3)
A4: IC10.14(PORT_F:P4)
A5: IC10.15(PORT_F:P5)
A6: IC10.50(PORT_F:P12)
A7: IC10.53(PORT_F:P13)
A8: IC10.54(PORT_F:P14)
A9: IC10.55(PORT_F:P15)
A10: IC10.56(PORT_G:P0)
A11: IC10.57(PORT_G:P1)
A12: IC10.87(PORT_G:P2)
A13: IC10.88(PORT_G:P3)
A14: IC10.89(PORT_G:P4)
A15: IC10.90(PORT_G:P5)
A16: IC10.80(PORT_D:P11)
A17: IC10.81(PORT_D:P12)
A18: IC10.82(PORT_D:P13)
A19: IC10.2(PORT_E:P3)
A20: IC10.3(PORT_E:P4)
A21: IC10.4(PORT_E:P5)
A22: IC10.5(PORT_E:P6)
A23: IC10.1(PORT_E:P2)
A24: IC10.128(PORT_G:P13)
A25: IC10.129(PORT_G:P14)
CLK: IC10.117(PORT_D:P3)
D0: IC10.85(PORT_D:P14) ; also sheet 2
D1: IC10.86(PORT_D:P15) ; also sheet 2
D2: IC10.114(PORT_D:P0) ; also sheet 2
D3: IC10.115(PORT_D:P1) ; also sheet 2
D4: IC10.58(PORT_E:P7) ; also sheet 2
D5: IC10.59(PORT_E:P8) ; also sheet 2
D6: IC10.60(PORT_E:P9) ; also sheet 2
D7: IC10.63(PORT_E:P10) ; also sheet 2
D8: IC10.64(PORT_E:P11) ; also sheet 2
D9: IC10.65(PORT_E:P12) ; also sheet 2
D10: IC10.66(PORT_E:P13) ; also sheet 2
D11: IC10.67(PORT_E:P14) ; also sheet 2
D12: IC10.68(PORT_E:P15) ; also sheet 2
D13: IC10.77(PORT_D:P8) ; also sheet 2
D14: IC10.78(PORT_D:P9) ; also sheet 2
D15: IC10.79(PORT_D:P10) ; also sheet 2
FSMC_NADV: IC10.137(PORT_B:P7)
GND: JP1.3(GND) JP1.5(GND) JP1.9(GNDDETECT) Q1.2(GND) R2.1 ; also sheet 1,2,3,4,6,7
N$1: IC10.23(OSC:OSC_IN) Q1.3(OUT)
N$34: IC10.134(PORT_B:P4) R33.1
NBL0: IC10.141(PORT_E:P0)
NBL1: IC10.142(PORT_E:P1)
NE1: IC10.123(PORT_D:P7)
NOE: IC10.118(PORT_D:P4)
NWAIT: IC10.122(PORT_D:P6)
NWE: IC10.119(PORT_D:P5)
PA0: IC10.34(PORT_A:P0-WKUP) ; also sheet 1
PA1: IC10.35(PORT_A:P1) ; also sheet 1
PA2: IC10.36(PORT_A:P2) ; also sheet 1
PA3: IC10.37(PORT_A:P3) ; also sheet 1
PA8: IC10.100(PORT_A:P8)
PB0: IC10.46(PORT_B:P0) ; also sheet 1
PB1: IC10.47(PORT_B:P1) ; also sheet 1
PB2: IC10.48(PORT_B:P2) R2.2
PB4: R33.2 ; also sheet 1
PB5: IC10.135(PORT_B:P5) ; also sheet 1
PB6: IC10.136(PORT_B:P6) ; also sheet 1
PB8: IC10.139(PORT_B:P8) ; also sheet 1
PB9: IC10.140(PORT_B:P9) ; also sheet 1
PB10: IC10.69(PORT_B:P10) ; also sheet 1
PB11: IC10.70(PORT_B:P11) ; also sheet 1
PB12: IC10.73(PORT_B:P12) ; also sheet 1
PB13: IC10.74(PORT_B:P13) ; also sheet 1
PB14: IC10.75(PORT_B:P14) ; also sheet 1
PB15: IC10.76(PORT_B:P15) ; also sheet 1
PC0: IC10.26(PORT_C:P0) ; also sheet 1
PC1: IC10.27(PORT_C:P1) ; also sheet 1
PC2: IC10.28(PORT_C:P2) ; also sheet 1
PC3: IC10.29(PORT_C:P3) ; also sheet 1
PC4: IC10.44(PORT_C:P4) ; also sheet 1
PC5: IC10.45(PORT_C:P5) ; also sheet 1
PC6: IC10.96(PORT_C:P6) ; also sheet 1
PC7: IC10.97(PORT_C:P7) ; also sheet 1
PC8: IC10.98(PORT_C:P8) ; also sheet 1
PC9: IC10.99(PORT_C:P9) ; also sheet 1
PC10: IC10.111(PORT_C:P10) ; also sheet 1
PC11: IC10.112(PORT_C:P11) ; also sheet 1
PC12: IC10.113(PORT_C:P12) ; also sheet 1
PC13: IC10.7(PORT_C:P13-TAMPER-RTC)
PC14: IC10.8(PORT_C:P14-OSC32-IN)
PD2: IC10.116(PORT_D:P2) ; also sheet 1
SD_DETECT: IC10.9(PORT_C:P15-OSC32-OUT) ; also sheet 7
SPI1_MISO: IC10.42(PORT_A:P6)
SPI1_MOSI: IC10.43(PORT_A:P7)
SPI1_NSS: IC10.40(PORT_A:P4)
SPI1_SCK: IC10.41(PORT_A:P5)
TCK: IC10.109(PORT_A:P14) JP1.4(TCK/SWCLK)
TDI: IC10.110(PORT_A:P15) JP1.8(TDI)
TDO: IC10.133(PORT_B:P3) JP1.6(TDO/SWO)
TMS: IC10.105(PORT_A:P13) JP1.2(TMS/SWIO)
USB_DM: IC10.103(PORT_A:P11) ; also sheet 7
USB_DP: IC10.104(PORT_A:P12) ; also sheet 7
USB_ID: IC10.102(PORT_A:P10) ; also sheet 7
USB_VBUS: IC10.101(PORT_A:P9) ; also sheet 4,7
Unconnected: IC10.18(PORT_F:P6) IC10.19(PORT_F:P7) IC10.20(PORT_F:P8) IC10.21(PORT_F:P9) IC10.22(PORT_F:P10) IC10.24(OSC:OSC_OUT) IC10.49(PORT_F:P11) IC10.91(PORT_G:P6) IC10.92(PORT_G:P7) IC10.93(PORT_G:P8) IC10.124(PORT_G:P9) IC10.125(PORT_G:P10) IC10.126(PORT_G:P11) IC10.127(PORT_G:P12) IC10.132(PORT_G:P15) JP1.7(RTCK) Q1.1(OE)

### Buses
!RESET,TRST,TMS,TCK,TDO,TDI
USB_VBUS,USB_DM,USB_DP,USB_ID
SPI1_NSS,SPI1_SCK,SPI1_MISO,SPI1_MOSI
PA[0..3],PA8,PB[0..2],PB[4..15],PC[0..14],FLASH_CS,PD2,SD_CS,PD[4..7],PD[12..15],PE[0..15]
FSMC:D[0..15],A[0..25],CLK,NOE,NWE,NWAIT,NE[1..3],NBL0,NBL1

### Notes on the sheet
- Encoder at T1..5 and T8
- PC13..15 only as Inputs!
- STM32
- (UART5 Rx)
- (U4 TX/T2.1/T5.1/ADC0) | (T3.1/ADC8) | (ADC10)
- (U4 RX/T2.2/T5.2/ADC1) | (T3.2/ADC9) | (ADC11)
- (U2 TX/T9.1/ADC2) | (BOOT1) | (ADC12)
- (U2 RX/T9.2/ADC3) | (ADC13)
- (T3.1) | (ADC14)
- (T3.2) | (ADC15)
- (UART1 Tx) | (T8.1/T3.1)
- (T8.2/T3.2)
- (CAN1 RX) | (T8.3/T3.3)
- (CAN1 TX) | (T8.4/T3.4)
- (I2C2 SCL/U3 Tx) | (U3 Tx/U4 Tx)
- (I2C2 SDA/U3 Rx) | (U3 Rx/U4 Rx)
- (SPI2 CS) | (UART5 Tx)
- (SPI2 SCK)
- (SPI2 MISO)
- (SPI2 MOSI)
- PC13..15 only as Inputs!
- for BOOT1

## Sheet 6 of 7
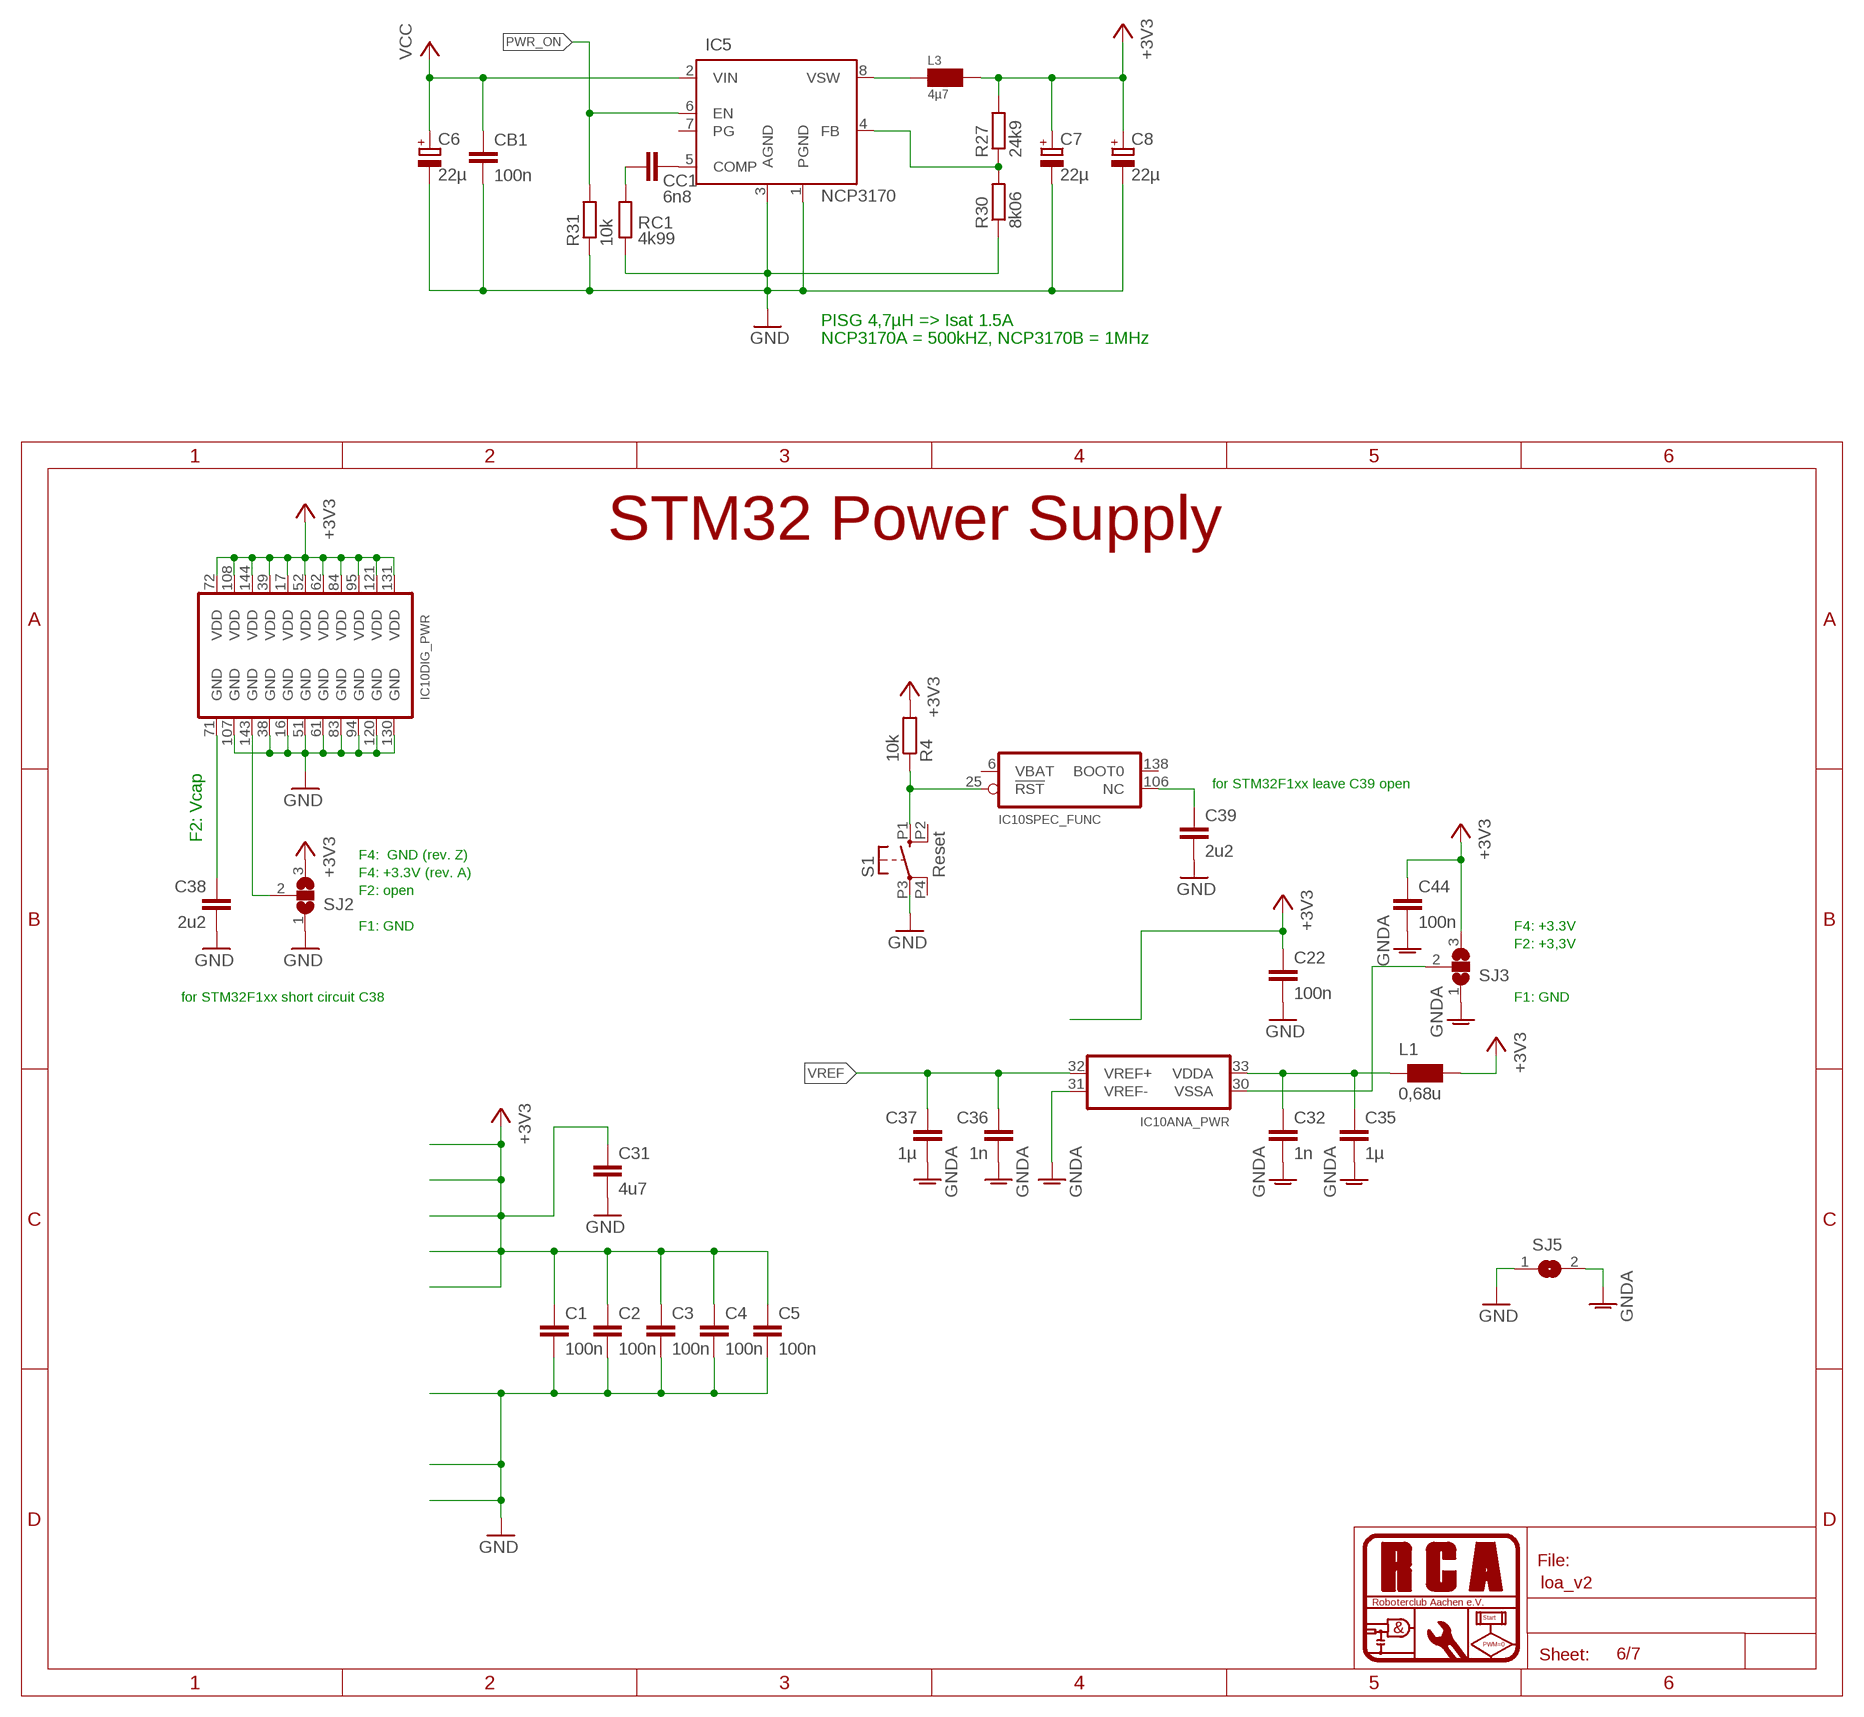
[diagram p7: schematic, sheet 6]

### Parts
C1  100n  C-EUC0603  [C0603]
C2  100n  C-EUC0603  [C0603]
C3  100n  C-EUC0603  [C0603]
C4  100n  C-EUC0603  [C0603]
C5  100n  C-EUC0603  [C0603]
C6  22µ  CPOL-EUSMCD  [SMC_D]
C7  22µ  CPOL-EUSMCC  [SMC_C]
C8  22µ  CPOL-EUSMCC  [SMC_C]
C22  100n  C-EUC0603  [C0603]
C31  4u7  C-EUC0805  [C0805]
C32  1n  C-EUC0603  [C0603]
C35  1µ  C-EUC0805  [C0805]
C36  1n  C-EUC0603  [C0603]
C37  1µ  C-EUC0805  [C0805]
C38  2u2  C-EUC0805  [C0805]
C39  2u2  C-EUC0805  [C0805]
C44  100n  C-EUC0603  [C0603]
CB1  100n  C-EUC0603  [C0603]
CC1  6n8  C-EUC0805  [C0805]
IC5  NCP3170  [SO08]
L1  0,68u  WE-KIHQ_0805  [WE-KI_0805_B]
L3  4µ7  INDUCTOR-PISG  [L-PISG]
R4  10k  R-EU_R0805  [R0805]
R27  24k9  R-EU_M0805  [M0805]
R30  8k06  R-EU_M0805  [M0805]
R31  10k  R-EU_M0805  [M0805]
RC1  4k99  R-EU_M0805  [M0805]
S1  Reset  10-XXLSH  [B3F-10XX-SMD]
SJ2  SJ2WS  [SJ_2S]
SJ3  SJ2WS  [SJ_2S]
SJ5  SJS  [SJS]

### Nets
!RESET: IC10.25(SPEC_FUNC:!RST) R4.1 S1.P1(S) ; also sheet 5
+3V3: C1.1 C2.1 C3.1 C4.1 C5.1 C7.+ C8.+ C22.1 C31.1 C44.1 IC10.17(DIG_PWR:VDD) IC10.39(DIG_PWR:VDD) IC10.52(DIG_PWR:VDD) IC10.62(DIG_PWR:VDD) IC10.72(DIG_PWR:VDD) IC10.84(DIG_PWR:VDD) IC10.95(DIG_PWR:VDD) IC10.108(DIG_PWR:VDD) IC10.121(DIG_PWR:VDD) IC10.131(DIG_PWR:VDD) IC10.144(DIG_PWR:VDD) L1.1 L3.2 R4.2 R27.2 SJ2.3 SJ3.3 ; also sheet 1,2,3,4,5,7
GND: C1.2 C2.2 C3.2 C4.2 C5.2 C6.- C7.- C8.- C22.2 C31.2 C38.2 C39.2 CB1.2 IC5.1(PGND) IC5.3(AGND) IC10.16(DIG_PWR:GND) IC10.38(DIG_PWR:GND) IC10.51(DIG_PWR:GND) IC10.61(DIG_PWR:GND) IC10.83(DIG_PWR:GND) IC10.94(DIG_PWR:GND) IC10.107(DIG_PWR:GND) IC10.120(DIG_PWR:GND) IC10.130(DIG_PWR:GND) R30.1 R31.1 RC1.1 S1.P3(P) SJ2.1 SJ5.1 ; also sheet 1,2,3,4,5,7
GNDA: C32.2 C35.2 C36.2 C37.2 C44.2 IC10.31(ANA_PWR:VREF-) SJ3.1 SJ5.2 ; also sheet 1
N$27: C38.1 IC10.71(DIG_PWR:GND)
N$28: IC10.143(DIG_PWR:GND) SJ2.2
N$29: C39.1 IC10.106(SPEC_FUNC:NC)
N$30: IC10.30(ANA_PWR:VSSA) SJ3.2
N$36: C32.1 C35.1 IC10.33(ANA_PWR:VDDA) L1.2
N$51: CC1.2 RC1.2
N$52: CC1.1 IC5.5(COMP)
N$53: IC5.8(VSW) L3.1
N$54: IC5.4(FB) R27.1 R30.2
PWR_ON: IC5.6(EN) R31.2
VCC: C6.+ CB1.1 IC5.2(VIN) ; also sheet 1,4
VREF: C36.1 C37.1 IC10.32(ANA_PWR:VREF+) ; also sheet 1
Unconnected: IC5.7(PG) IC10.6(SPEC_FUNC:VBAT) IC10.138(SPEC_FUNC:BOOT0) S1.P2(S1) S1.P4(P1)

### Notes on the sheet
- PISG 4,7µH => Isat 1.5A
- NCP3170A = 500kHZ, NCP3170B = 1MHz
- STM32 Power Supply
- for STM32F1xx leave C39 open
- F2: Vcap
- F4:  GND (rev. Z)
- F4: +3.3V (rev. A)
- F2: open
- F1: GND | F4: +3.3V
- F2: +3,3V
- for STM32F1xx short circuit C38 | F1: GND

## Sheet 7 of 7
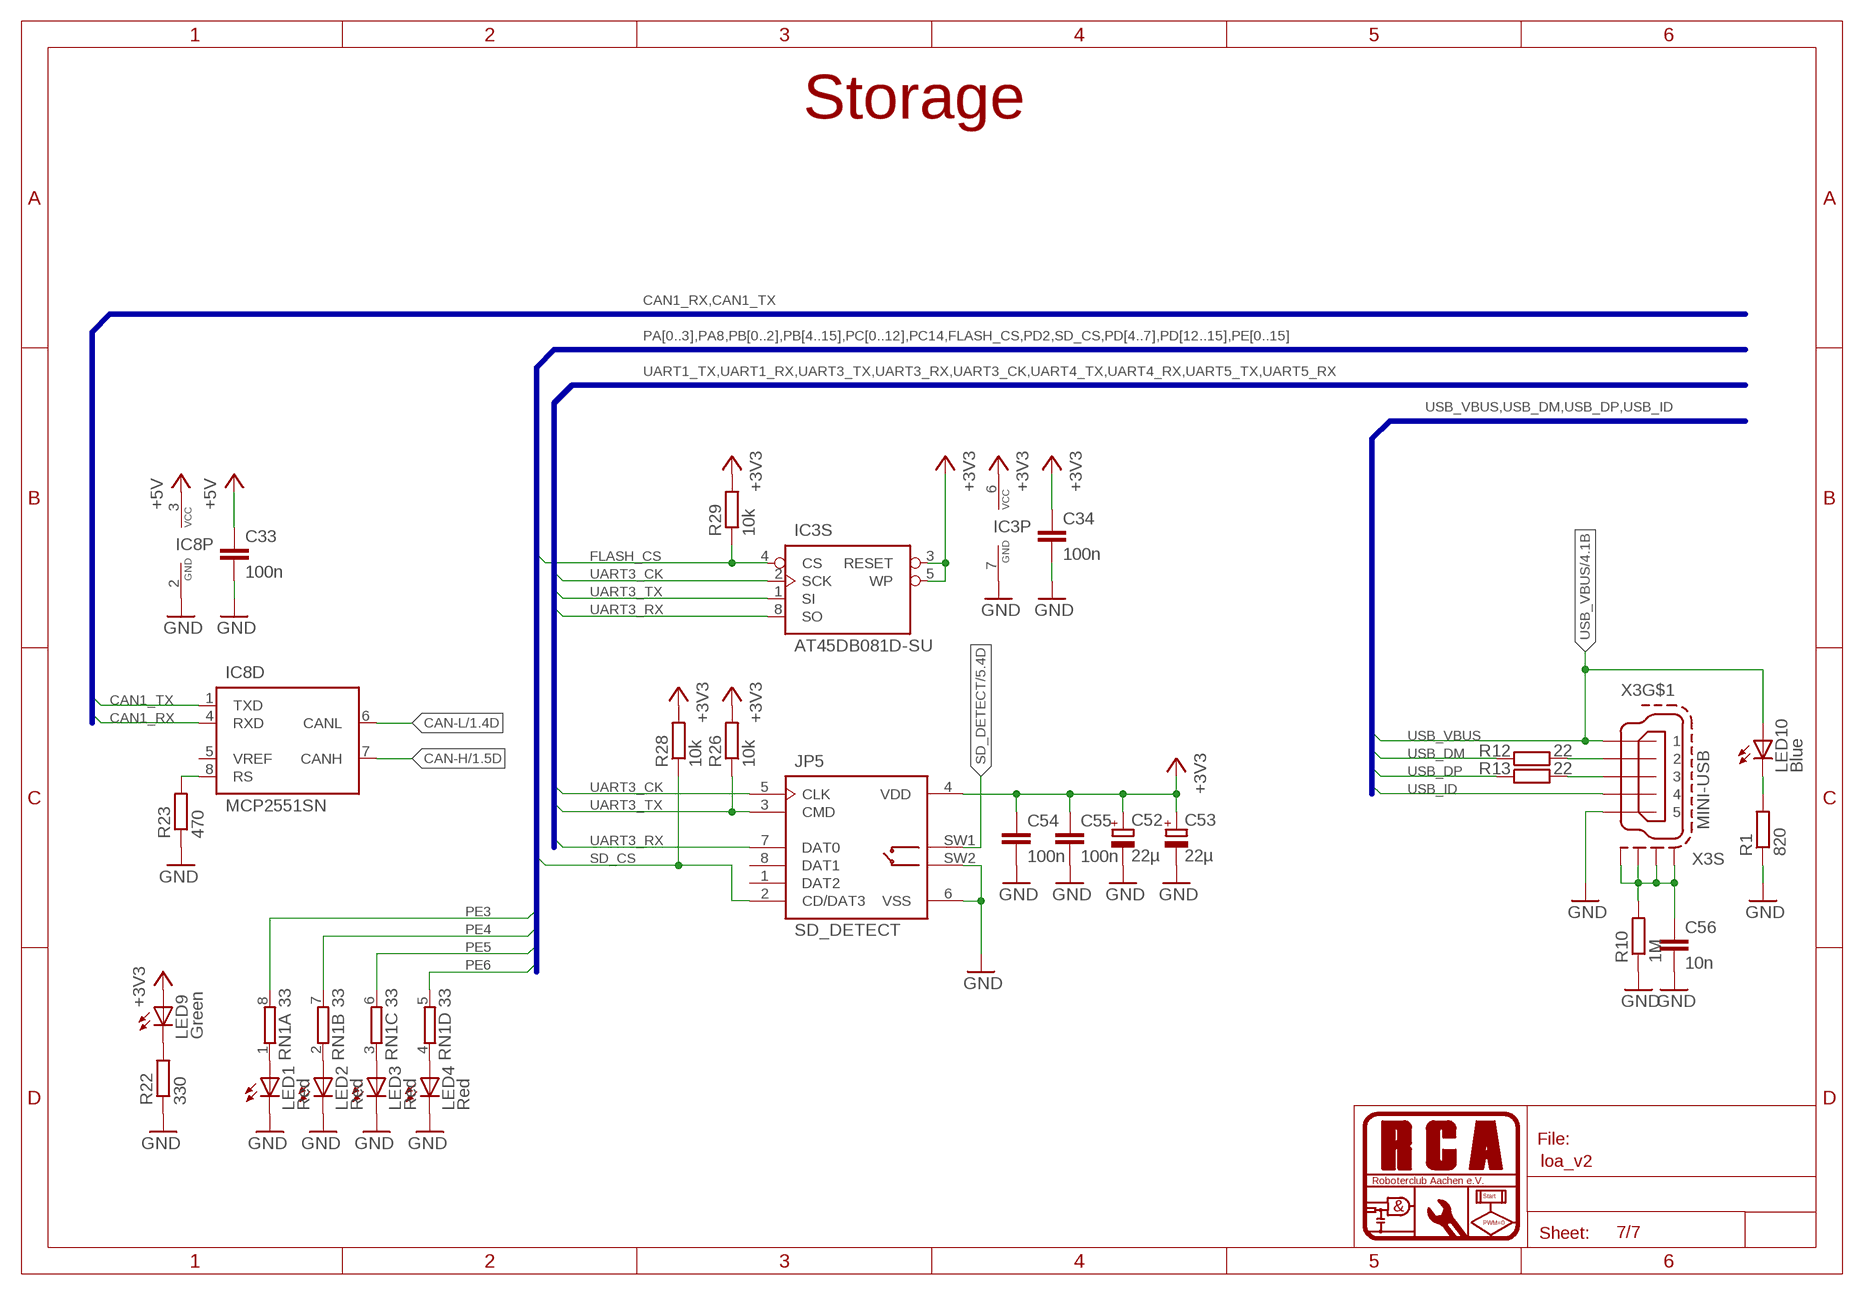
[diagram p8: schematic, sheet 7]

### Parts
C33  100n  C-EUC0603  [C0603]
C34  100n  C-EUC0805  [C0805]
C52  22µ  CPOL-EUSMCC  [SMC_C]
C53  22µ  CPOL-EUSMCC  [SMC_C]
C54  100n  C-EUC0603  [C0603]
C55  100n  C-EUC0603  [C0603]
C56  10n  C-EUC0603  [C0603]
IC3  AT45DB081D-SU  AT45DB041DS  [SO-08M]
IC8  MCP2551SN  [SOIC-8]
JP5  SD_DETECT  [SD_MOLEX_49225-0821]
LED1  Red  LEDCHIPLED_0805  [CHIPLED_0805]
LED2  Red  LEDCHIPLED_0805  [CHIPLED_0805]
LED3  Red  LEDCHIPLED_0805  [CHIPLED_0805]
LED4  Red  LEDCHIPLED_0805  [CHIPLED_0805]
LED9  Green  LEDCHIPLED_0805  [CHIPLED_0805]
LED10  Blue  LEDCHIPLED_0805  [CHIPLED_0805]
R1  820  R-EU_R0805  [R0805]
R10  1M  R-EU_R0805  [R0805]
R12  22  R-EU_R0603  [R0603]
R13  22  R-EU_R0603  [R0603]
R22  330  R-EU_R0805  [R0805]
R23  470  R-EU_R0805  [R0805]
R26  10k  R-EU_M0805  [M0805]
R28  10k  R-EU_M0805  [M0805]
R29  10k  R-EU_M0805  [M0805]
RN1  33  4R-NEXB38V  [EXB38V]
X3  MINI-USB  MINI-USB-SCHIELD-32005-201  [32005-201]

### Nets
+3V3: C34.1 C52.+ C53.+ C54.1 C55.1 IC3.3(S:RESET) IC3.5(S:WP) IC3.6(P:VCC) JP5.4(VDD) LED9.A R26.2 R28.2 R29.2 ; also sheet 1,2,3,4,5,6
+5V: C33.1 IC8.3(P:VCC) ; also sheet 4
CAN1_RX: IC8.4(D:RXD)
CAN1_TX: IC8.1(D:TXD)
CAN-H: IC8.7(D:CANH) ; also sheet 1
CAN-L: IC8.6(D:CANL) ; also sheet 1
FLASH_CS: IC3.4(S:CS) R29.1
GND: C33.2 C34.2 C52.- C53.- C54.2 C55.2 C56.2 IC3.7(P:GND) IC8.2(P:GND) JP5.6(VSS) JP5.SW2 LED1.C LED2.C LED3.C LED4.C R1.1 R10.1 R22.1 R23.1 X3.5 ; also sheet 1,2,3,4,5,6
N$16: R12.2 X3.2
N$17: R13.2 X3.3
N$18: LED4.A RN1.4
N$19: LED3.A RN1.3
N$20: LED2.A RN1.2
N$21: LED1.A RN1.1
N$26: LED9.C R22.2
N$31: IC8.8(D:RS) R23.2
N$33: LED10.C R1.2
N$42: C56.1 R10.2 X3.M1(S:S1) X3.M2(S:S2) X3.M3(S:S3) X3.M4(S:S4)
PE3: RN1.8
PE4: RN1.7
PE5: RN1.6
PE6: RN1.5
SD_CS: JP5.2(CD/DAT3) R28.1
SD_DETECT: JP5.SW1 ; also sheet 5
UART3_CK: IC3.2(S:SCK) JP5.5(CLK)
UART3_RX: IC3.8(S:SO) JP5.7(DAT0)
UART3_TX: IC3.1(S:SI) JP5.3(CMD) R26.1
USB_DM: R12.1 ; also sheet 5
USB_DP: R13.1 ; also sheet 5
USB_ID: X3.4 ; also sheet 5
USB_VBUS: LED10.A X3.1 ; also sheet 4,5
Unconnected: IC8.5(D:VREF) JP5.1(DAT2) JP5.8(DAT1)

### Buses
USB_VBUS,USB_DM,USB_DP,USB_ID
CAN1_RX,CAN1_TX
UART1_TX,UART1_RX,UART3_TX,UART3_RX,UART3_CK,UART4_TX,UART4_RX,UART5_TX,UART5_RX
PA[0..3],PA8,PB[0..2],PB[4..15],PC[0..12],PC14,FLASH_CS,PD2,SD_CS,PD[4..7],PD[12..15],PE[0..15]

### Notes on the sheet
- Storage

## Library data of the parts
C1-C5 C9-C39 C44-C51 C54-C58 CB1 CC1 = rcl:C-EU: CAPACITOR, European symbol
C6-C8 C52 C53 = rcl:CPOL-EU: POLARIZED CAPACITOR, European symbol
D1 = diode:DIODE-: DIODE
D2 = diode:BAT54C: Schottky Diodes Source: Fairchild .. BAT54.pdf
IC2 = 74xx-eu:74*02: Quad 2-input NOR gate
IC3 = rca_ic:AT45DB: AT45DBxxxD Single 2.5V or 2.7V to 3.6V Supply Serial Interface: 66 MHz Maximum Clock Frequency AT45DB041D: 4,325,376 bits of memory as 2,048 pages of 256 bytes
IC4 = rca_spgversorgung:MCP182*
IC5 = rca_spgversorgung:NCP3170: Synchronous PWM Switching Converter The NCP3170 is a flexible synchronous PWM Switching Buck Regulator. The NCP3170 operates from 4.5V to 18V, sourcing up to 3A and is capable of producing output voltages as low as 0.8V. The NCP3170 also incorporates current mode control. To reduce the number of external components, a number of features are internally set including soft start, power good detection, and switching frequency. The NCP3170 is currently available in an SOIC-8 package.
IC6 = rca_ic:AD726*: AD7266/5 Differential/Single-Ended Input, Dual 2 MSPS, 12-Bit, 3-Channel SAR ADC Dual 12-bit, 3-channel ADC Throughput rate: 2 MSPS Specified for VDD of 2.7 V to 5.25 V Power consumption 9 mW at 1.5 MSPS with 3 V supplies 27 mW at 2 MSPS with 5 V supplies Pin-configurable analog inputs 12-channel single-ended inputs 6-channel fully differential inputs 6-channel pseudo differential inputs 70 dB SNR at 50 kHz input frequency Accurate on-chip reference: 2.5 V ±0.2% maximum @ 25°C, 20 ppm/°C maximum Dual conversion with read 437.5 ns, 32 MHz SCLK High speed serial interface SPI®-/QSPITM-/MICROWIRETM-/DSP-compatible ?40°C to +125°C operation Shutdown mode: 1 ?A maximum 1 MSPS version, AD7265
IC7 = rca_spgversorgung:MIC5205: MIC5205 150mA Low-Noise LDO Regulator The MIC5205 is an efficient linear voltage regulator with ultra low-noise output, very low dropout voltage (typically 17mV at light loads and 165mV at 150mA), and very low ground current (600µA at 100mA output). The MIC5205 offers better than 1% initial accuracy.
IC8 = rca_ic:MCP2551: High-Speed CAN Transceiver
IC10 = stm32:STM32F10XZX: 72 MHz, 64KB RAM, 512 KB Flash
JP1 = rca_stecker:CORTEX_JTAG
JP5 = rca_stecker:SD_DETECT
JP7 JP8 = pinhead2:PINHD-2X32
L1 L4 = wuerth-elektronik:WE-KIHQ: SMD Wire Wound Ceramic Inductor WE-KIHQ - High current - Highest Quality factor in size 0805 - up to 98 - High thermal stability - High SRF -- Bluetooth -- Wireless LAN -- RF oscillation circuit -- IF impedance matching -- IG choke
L3 = rca_sontiges:INDUCTOR: SMD-Power-Induktivitäten z.B. PISM, Ferrit, 150µ, Reichelt Bestellnr.: L-PISM 150µ
LED1-LED12 = led:LED: LED OSRAM: - CHIPLED LG R971, LG N971, LY N971, LG Q971, LY Q971, LO R971, LY R971 LH N974, LH R974 LS Q976, LO Q976, LY Q976 LO Q996 - Hyper CHIPLED LW Q18S LB Q993, LB Q99A, LB R99A - SideLED LS A670, LO A670, LY A670, LG A670, LP A670 LB A673, LV A673, LT A673, LW A673 LH A674 LY A675 LS A676, LA A676, LO A676, LY A676, LW A676 LS A679, LY A679, LG A679 - Hyper Micro SIDELED® LS Y876, LA Y876, LO Y876, LY Y876 LT Y87S - SmartLED LW L88C, LW L88S LB L89C, LB L89S, LG L890 LS L89K, LO L89K, LY L89K LS L896, LA L896, LO L896, LY L896 - TOPLED LS T670, LO T670, LY T670, LG T670, LP T670 LSG T670, LSP T670, LSY T670, LOP T670, LYG T670 LG T671, LOG T671, LSG T671 LB T673, LV T673, LT T673, LW T673 LH T674 LS T676, LA T676, LO T676, LY T676, LB T676, LH T676, LSB T676, LW T676 LB T67C, LV T67C, LT T67C, LS T67K, LO T67K, LY T67K, LW E67C LS E67B, LA E67B, LO E67B, LY E67B, LB E67C, LV E67C, LT E67C LW T67C LS T679, LY T679, LG T679 LS T770, LO T770, LY T770, LG T770, LP T770 LB T773, LV T773, LT T773, LW T773 LH T774 LS E675, LA E675, LY E675, LS T675 LS T776, LA T776, LO T776, LY T776, LB T776 LHGB T686 LT T68C, LB T68C - Hyper Mini TOPLED® LB M676 - Mini TOPLED Santana® LG M470 LS M47K, LO M47K, LY M47K Source: http://www.osram.convergy.de LUXEON: - LUMILED® LXK2-PW12-R00, LXK2-PW12-S00, LXK2-PW14-U00, LXK2-PW14-V00 LXK2-PM12-R00, LXK2-PM12-S00, LXK2-PM14-U00 LXK2-PE12-Q00, LXK2-PE12-R00, LXK2-PE12-S00, LXK2-PE14-T00, LXK2-PE14-U00 LXK2-PB12-K00, LXK2-PB12-L00, LXK2-PB12-M00, LXK2-PB14-N00, LXK2-PB14-P00, LXK2-PB14-Q00 LXK2-PR12-L00, LXK2-PR12-M00, LXK2-PR14-Q00, LXK2-PR14-R00 LXK2-PD12-Q00, LXK2-PD12-R00, LXK2-PD12-S00 LXK2-PH12-R00, LXK2-PH12-S00 LXK2-PL12-P00, LXK2-PL12-Q00, LXK2-PL12-R00 Source: www.luxeon.com KINGBRIGHT: KA-3528ASYC Source: www.kingbright.com
Q1 Q2 = rca_sontiges:XO: XO91 Series Oscillators Frequency Range 500 kHz to 125 MHz Supply voltage range 1.8, 2.5, 3.3 or 5.0 Volts Gibt es in der 3,3V Version bei Reichelt (XO91 #Wert) Datenblatt: http://www.reichelt.de/?;ACTION=7;LA=6;OPEN=0;INDEX=0;FILENAME=B400%252FXO91.pdf XO53 Series Oscillators Frequency Range 2.5 MHz to 125 MHz Supply voltage range 1.8, 2.5, 3.3 Volts Gibt es in der 3,3V Version bei Reichelt (XO53 #Wert)
R1 R2 R4-R13 R18-R33 RC1 = rcl:R-EU_: RESISTOR, European symbol
RN1 RN3 RN4 RN6 RN7 = resistor-dil:4R-N: Array Chip Resistor Source: RS Component / Phycomp; OC_FARNELL: unknown; OC_NEWARK: unknown
S1 = rca_sontiges:10-XX*: OMRON SWITCH
SJ2 SJ3 = rca_sontiges:SJ2W: SMD solder JUMPER
SJ5 = rca_sontiges:SJ: SMD solder JUMPER
U1 = xilinx_devices:6SLX9TQG144: Xilinx FPGA: 6SLX9TQG144
X3 = con-cypressindustries:MINI-USB-SCHIELD-: MINI USB-B Conector Source: www.cypressindustries.com